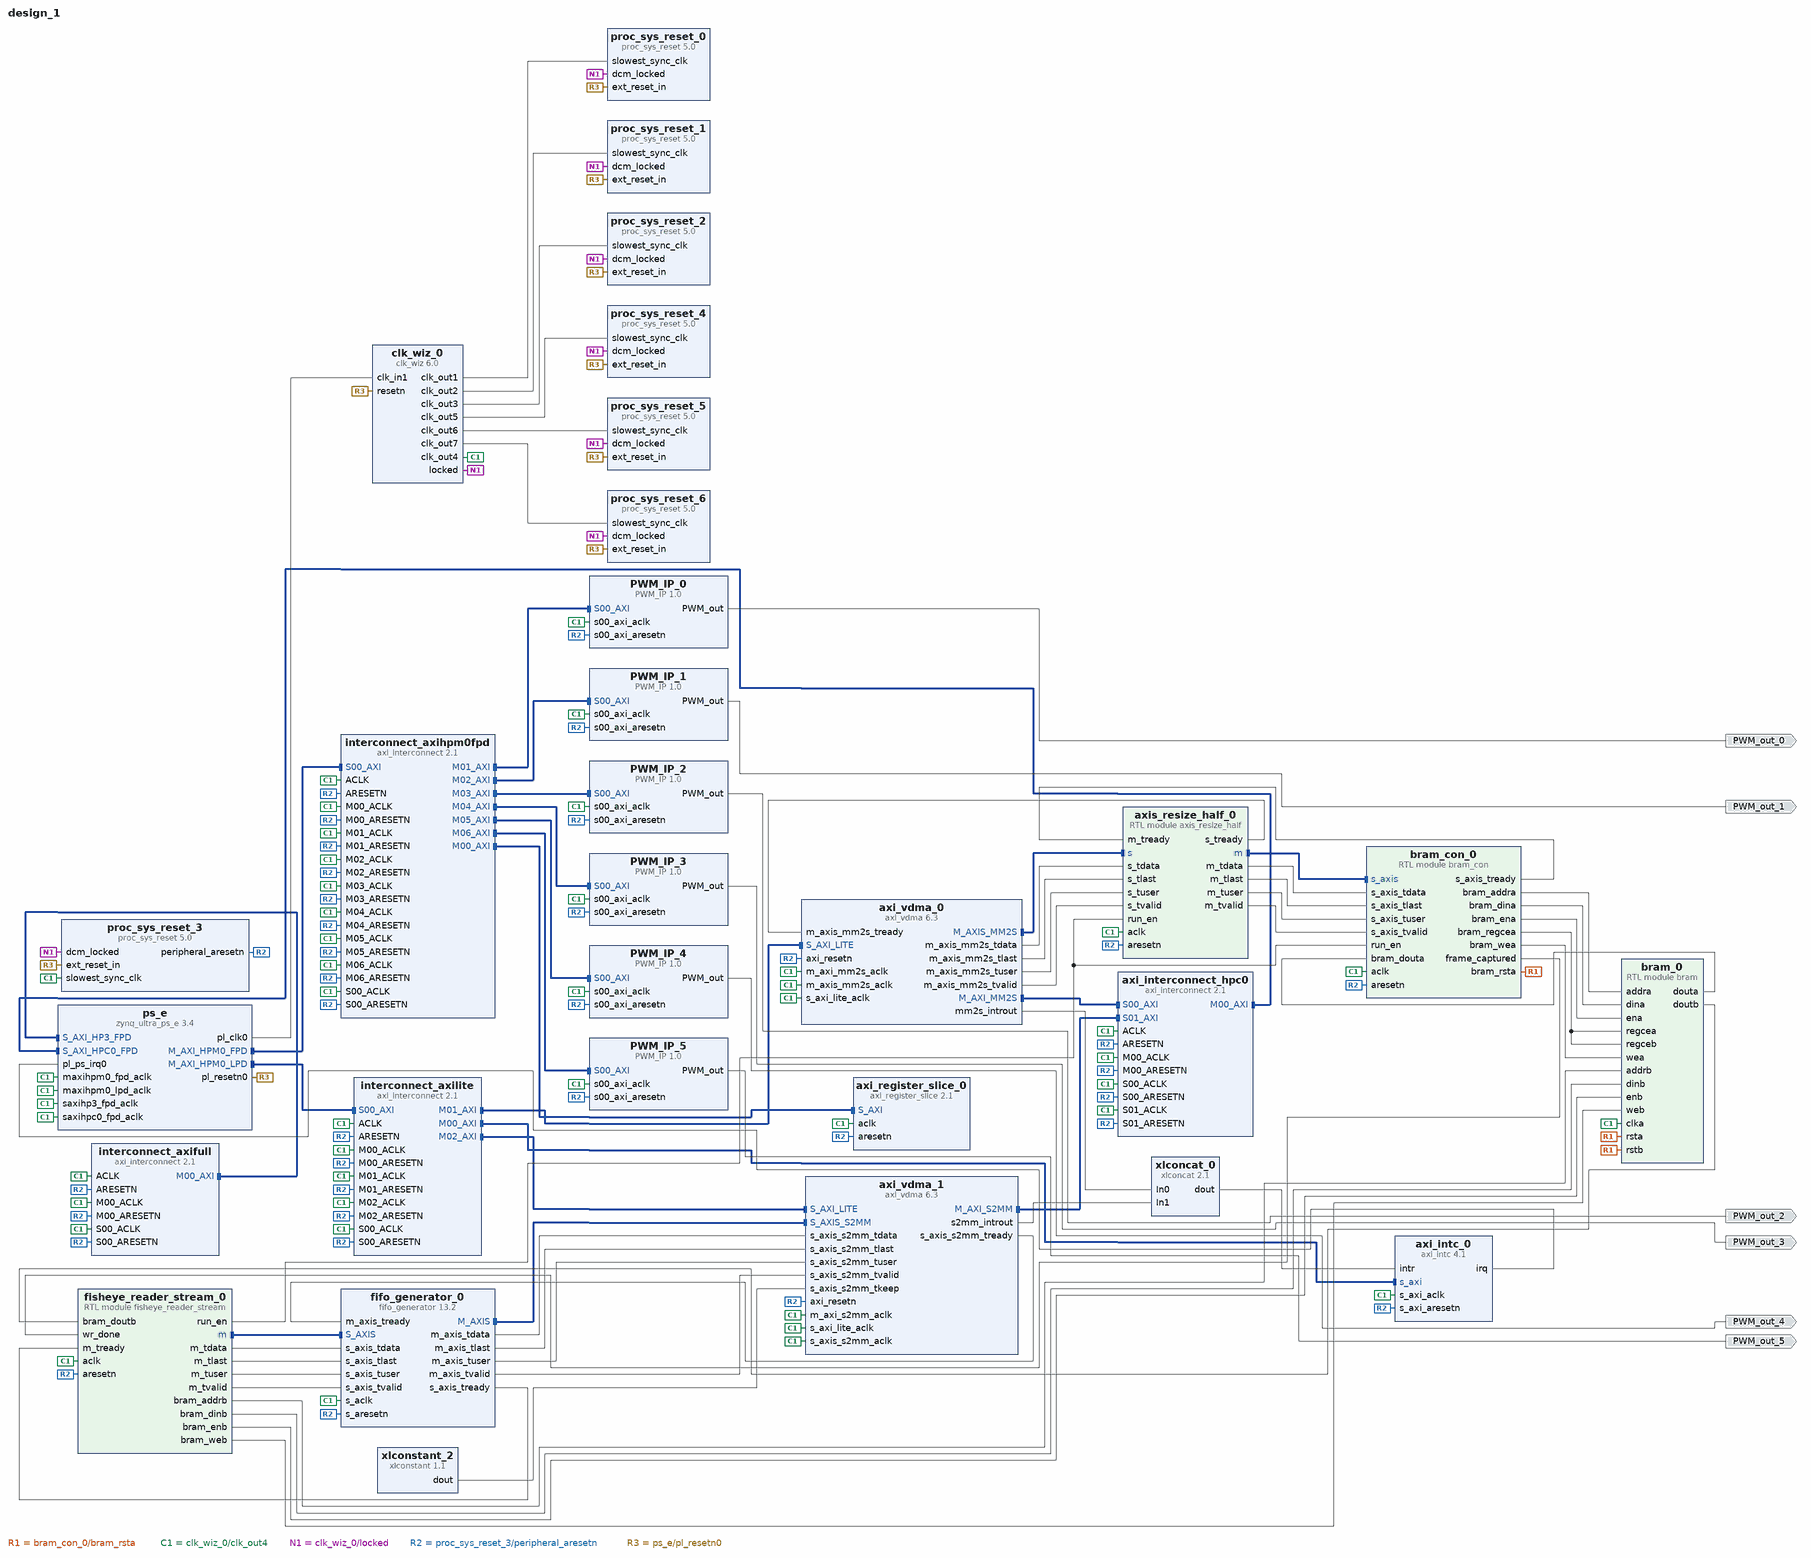
[diagram p0: block diagram of the top level]
# Vivado block design design_1, xczu3eg-sbva484-1-i, Vivado 2022.1
create_bd_design design_1

create_bd_port -dir O PWM_out_0
create_bd_port -dir O PWM_out_1
create_bd_port -dir O PWM_out_2
create_bd_port -dir O PWM_out_3
create_bd_port -dir O PWM_out_4
create_bd_port -dir O PWM_out_5

create_bd_cell -type ip -vlnv xilinx.com:ip:axi_intc:4.1 axi_intc_0
set_property -dict [list \
  CONFIG.C_ASYNC_INTR 0xFFFFFFFF \
  CONFIG.C_CASCADE_MASTER 0 \
  CONFIG.C_DISABLE_SYNCHRONIZERS 0 \
  CONFIG.C_ENABLE_ASYNC 0 \
  CONFIG.C_EN_CASCADE_MODE 0 \
  CONFIG.C_HAS_CIE 1 \
  CONFIG.C_HAS_FAST 0 \
  CONFIG.C_HAS_ILR 0 \
  CONFIG.C_HAS_IPR 1 \
  CONFIG.C_HAS_IVR 1 \
  CONFIG.C_HAS_SIE 1 \
  CONFIG.C_IRQ_ACTIVE 0x1 \
  CONFIG.C_IRQ_CONNECTION 1 \
  CONFIG.C_IRQ_IS_LEVEL 1 \
  CONFIG.C_KIND_OF_EDGE 0xFFFFFFFF \
  CONFIG.C_KIND_OF_INTR 0xFFFFFFFF \
  CONFIG.C_KIND_OF_LVL 0xFFFFFFFF \
  CONFIG.C_MB_CLK_NOT_CONNECTED 1 \
  CONFIG.C_NUM_SW_INTR 0 \
  CONFIG.C_NUM_SYNC_FF 2 \
  CONFIG.C_PROCESSOR_CLK_FREQ_MHZ 100.0 \
  CONFIG.C_S_AXI_ACLK_FREQ_MHZ 75.0 \
  CONFIG.Sense_of_IRQ_Edge_Type Rising \
  CONFIG.Sense_of_IRQ_Level_Type Active_High \
] [get_bd_cells axi_intc_0]
create_bd_cell -type ip -vlnv xilinx.com:ip:axi_interconnect:2.1 axi_interconnect_hpc0
set_property -dict [list \
  CONFIG.ENABLE_ADVANCED_OPTIONS 0 \
  CONFIG.ENABLE_PROTOCOL_CHECKERS 0 \
  CONFIG.M00_HAS_DATA_FIFO 0 \
  CONFIG.M00_HAS_REGSLICE 0 \
  CONFIG.M00_ISSUANCE 0 \
  CONFIG.M00_SECURE 0 \
  CONFIG.M01_HAS_DATA_FIFO 0 \
  CONFIG.M01_HAS_REGSLICE 0 \
  CONFIG.M01_ISSUANCE 0 \
  CONFIG.M01_SECURE 0 \
  CONFIG.M02_HAS_DATA_FIFO 0 \
  CONFIG.M02_HAS_REGSLICE 0 \
  CONFIG.M02_ISSUANCE 0 \
  CONFIG.M02_SECURE 0 \
  CONFIG.M03_HAS_DATA_FIFO 0 \
  CONFIG.M03_HAS_REGSLICE 0 \
  CONFIG.M03_ISSUANCE 0 \
  CONFIG.M03_SECURE 0 \
  CONFIG.M04_HAS_DATA_FIFO 0 \
  CONFIG.M04_HAS_REGSLICE 0 \
  CONFIG.M04_ISSUANCE 0 \
  CONFIG.M04_SECURE 0 \
  CONFIG.M05_HAS_DATA_FIFO 0 \
  CONFIG.M05_HAS_REGSLICE 0 \
  CONFIG.M05_ISSUANCE 0 \
  CONFIG.M05_SECURE 0 \
  CONFIG.M06_HAS_DATA_FIFO 0 \
  CONFIG.M06_HAS_REGSLICE 0 \
  CONFIG.M06_ISSUANCE 0 \
  CONFIG.M06_SECURE 0 \
  CONFIG.M07_HAS_DATA_FIFO 0 \
  CONFIG.M07_HAS_REGSLICE 0 \
  CONFIG.M07_ISSUANCE 0 \
  CONFIG.M07_SECURE 0 \
  CONFIG.M08_HAS_DATA_FIFO 0 \
  CONFIG.M08_HAS_REGSLICE 0 \
  CONFIG.M08_ISSUANCE 0 \
  CONFIG.M08_SECURE 0 \
  CONFIG.M09_HAS_DATA_FIFO 0 \
  CONFIG.M09_HAS_REGSLICE 0 \
  CONFIG.M09_ISSUANCE 0 \
  CONFIG.M09_SECURE 0 \
  CONFIG.M10_HAS_DATA_FIFO 0 \
  CONFIG.M10_HAS_REGSLICE 0 \
  CONFIG.M10_ISSUANCE 0 \
  CONFIG.M10_SECURE 0 \
  CONFIG.M11_HAS_DATA_FIFO 0 \
  CONFIG.M11_HAS_REGSLICE 0 \
  CONFIG.M11_ISSUANCE 0 \
  CONFIG.M11_SECURE 0 \
  CONFIG.M12_HAS_DATA_FIFO 0 \
  CONFIG.M12_HAS_REGSLICE 0 \
  CONFIG.M12_ISSUANCE 0 \
  CONFIG.M12_SECURE 0 \
  CONFIG.M13_HAS_DATA_FIFO 0 \
  CONFIG.M13_HAS_REGSLICE 0 \
  CONFIG.M13_ISSUANCE 0 \
  CONFIG.M13_SECURE 0 \
  CONFIG.M14_HAS_DATA_FIFO 0 \
  CONFIG.M14_HAS_REGSLICE 0 \
  CONFIG.M14_ISSUANCE 0 \
  CONFIG.M14_SECURE 0 \
  CONFIG.M15_HAS_DATA_FIFO 0 \
  CONFIG.M15_HAS_REGSLICE 0 \
  CONFIG.M15_ISSUANCE 0 \
  CONFIG.M15_SECURE 0 \
  CONFIG.M16_HAS_DATA_FIFO 0 \
  CONFIG.M16_HAS_REGSLICE 0 \
  CONFIG.M16_ISSUANCE 0 \
  CONFIG.M16_SECURE 0 \
  CONFIG.M17_HAS_DATA_FIFO 0 \
  CONFIG.M17_HAS_REGSLICE 0 \
  CONFIG.M17_ISSUANCE 0 \
  CONFIG.M17_SECURE 0 \
  CONFIG.M18_HAS_DATA_FIFO 0 \
  CONFIG.M18_HAS_REGSLICE 0 \
  CONFIG.M18_ISSUANCE 0 \
  CONFIG.M18_SECURE 0 \
  CONFIG.M19_HAS_DATA_FIFO 0 \
  CONFIG.M19_HAS_REGSLICE 0 \
  CONFIG.M19_ISSUANCE 0 \
  CONFIG.M19_SECURE 0 \
  CONFIG.M20_HAS_DATA_FIFO 0 \
  CONFIG.M20_HAS_REGSLICE 0 \
  CONFIG.M20_ISSUANCE 0 \
  CONFIG.M20_SECURE 0 \
  CONFIG.M21_HAS_DATA_FIFO 0 \
  CONFIG.M21_HAS_REGSLICE 0 \
  CONFIG.M21_ISSUANCE 0 \
  CONFIG.M21_SECURE 0 \
  CONFIG.M22_HAS_DATA_FIFO 0 \
  CONFIG.M22_HAS_REGSLICE 0 \
  CONFIG.M22_ISSUANCE 0 \
  CONFIG.M22_SECURE 0 \
  CONFIG.M23_HAS_DATA_FIFO 0 \
  CONFIG.M23_HAS_REGSLICE 0 \
  CONFIG.M23_ISSUANCE 0 \
  CONFIG.M23_SECURE 0 \
  CONFIG.M24_HAS_DATA_FIFO 0 \
  CONFIG.M24_HAS_REGSLICE 0 \
  CONFIG.M24_ISSUANCE 0 \
  CONFIG.M24_SECURE 0 \
  CONFIG.M25_HAS_DATA_FIFO 0 \
  CONFIG.M25_HAS_REGSLICE 0 \
  CONFIG.M25_ISSUANCE 0 \
  CONFIG.M25_SECURE 0 \
  CONFIG.M26_HAS_DATA_FIFO 0 \
  CONFIG.M26_HAS_REGSLICE 0 \
  CONFIG.M26_ISSUANCE 0 \
  CONFIG.M26_SECURE 0 \
  CONFIG.M27_HAS_DATA_FIFO 0 \
  CONFIG.M27_HAS_REGSLICE 0 \
  CONFIG.M27_ISSUANCE 0 \
  CONFIG.M27_SECURE 0 \
  CONFIG.M28_HAS_DATA_FIFO 0 \
  CONFIG.M28_HAS_REGSLICE 0 \
  CONFIG.M28_ISSUANCE 0 \
  CONFIG.M28_SECURE 0 \
  CONFIG.M29_HAS_DATA_FIFO 0 \
  CONFIG.M29_HAS_REGSLICE 0 \
  CONFIG.M29_ISSUANCE 0 \
  CONFIG.M29_SECURE 0 \
  CONFIG.M30_HAS_DATA_FIFO 0 \
  CONFIG.M30_HAS_REGSLICE 0 \
  CONFIG.M30_ISSUANCE 0 \
  CONFIG.M30_SECURE 0 \
  CONFIG.M31_HAS_DATA_FIFO 0 \
  CONFIG.M31_HAS_REGSLICE 0 \
  CONFIG.M31_ISSUANCE 0 \
  CONFIG.M31_SECURE 0 \
  CONFIG.M32_HAS_DATA_FIFO 0 \
  CONFIG.M32_HAS_REGSLICE 0 \
  CONFIG.M32_ISSUANCE 0 \
  CONFIG.M32_SECURE 0 \
  CONFIG.M33_HAS_DATA_FIFO 0 \
  CONFIG.M33_HAS_REGSLICE 0 \
  CONFIG.M33_ISSUANCE 0 \
  CONFIG.M33_SECURE 0 \
  CONFIG.M34_HAS_DATA_FIFO 0 \
  CONFIG.M34_HAS_REGSLICE 0 \
  CONFIG.M34_ISSUANCE 0 \
  CONFIG.M34_SECURE 0 \
  CONFIG.M35_HAS_DATA_FIFO 0 \
  CONFIG.M35_HAS_REGSLICE 0 \
  CONFIG.M35_ISSUANCE 0 \
  CONFIG.M35_SECURE 0 \
  CONFIG.M36_HAS_DATA_FIFO 0 \
  CONFIG.M36_HAS_REGSLICE 0 \
  CONFIG.M36_ISSUANCE 0 \
  CONFIG.M36_SECURE 0 \
  CONFIG.M37_HAS_DATA_FIFO 0 \
  CONFIG.M37_HAS_REGSLICE 0 \
  CONFIG.M37_ISSUANCE 0 \
  CONFIG.M37_SECURE 0 \
  CONFIG.M38_HAS_DATA_FIFO 0 \
  CONFIG.M38_HAS_REGSLICE 0 \
  CONFIG.M38_ISSUANCE 0 \
  CONFIG.M38_SECURE 0 \
  CONFIG.M39_HAS_DATA_FIFO 0 \
  CONFIG.M39_HAS_REGSLICE 0 \
  CONFIG.M39_ISSUANCE 0 \
  CONFIG.M39_SECURE 0 \
  CONFIG.M40_HAS_DATA_FIFO 0 \
  CONFIG.M40_HAS_REGSLICE 0 \
  CONFIG.M40_ISSUANCE 0 \
  CONFIG.M40_SECURE 0 \
  CONFIG.M41_HAS_DATA_FIFO 0 \
  CONFIG.M41_HAS_REGSLICE 0 \
  CONFIG.M41_ISSUANCE 0 \
  CONFIG.M41_SECURE 0 \
  CONFIG.M42_HAS_DATA_FIFO 0 \
  CONFIG.M42_HAS_REGSLICE 0 \
  CONFIG.M42_ISSUANCE 0 \
  CONFIG.M42_SECURE 0 \
  CONFIG.M43_HAS_DATA_FIFO 0 \
  CONFIG.M43_HAS_REGSLICE 0 \
  CONFIG.M43_ISSUANCE 0 \
  CONFIG.M43_SECURE 0 \
  CONFIG.M44_HAS_DATA_FIFO 0 \
  CONFIG.M44_HAS_REGSLICE 0 \
  CONFIG.M44_ISSUANCE 0 \
  CONFIG.M44_SECURE 0 \
  CONFIG.M45_HAS_DATA_FIFO 0 \
  CONFIG.M45_HAS_REGSLICE 0 \
  CONFIG.M45_ISSUANCE 0 \
  CONFIG.M45_SECURE 0 \
  CONFIG.M46_HAS_DATA_FIFO 0 \
  CONFIG.M46_HAS_REGSLICE 0 \
  CONFIG.M46_ISSUANCE 0 \
  CONFIG.M46_SECURE 0 \
  CONFIG.M47_HAS_DATA_FIFO 0 \
  CONFIG.M47_HAS_REGSLICE 0 \
  CONFIG.M47_ISSUANCE 0 \
  CONFIG.M47_SECURE 0 \
  CONFIG.M48_HAS_DATA_FIFO 0 \
  CONFIG.M48_HAS_REGSLICE 0 \
  CONFIG.M48_ISSUANCE 0 \
  CONFIG.M48_SECURE 0 \
  CONFIG.M49_HAS_DATA_FIFO 0 \
  CONFIG.M49_HAS_REGSLICE 0 \
  CONFIG.M49_ISSUANCE 0 \
  CONFIG.M49_SECURE 0 \
  CONFIG.M50_HAS_DATA_FIFO 0 \
  CONFIG.M50_HAS_REGSLICE 0 \
  CONFIG.M50_ISSUANCE 0 \
  CONFIG.M50_SECURE 0 \
  CONFIG.M51_HAS_DATA_FIFO 0 \
  CONFIG.M51_HAS_REGSLICE 0 \
  CONFIG.M51_ISSUANCE 0 \
  CONFIG.M51_SECURE 0 \
  CONFIG.M52_HAS_DATA_FIFO 0 \
  CONFIG.M52_HAS_REGSLICE 0 \
  CONFIG.M52_ISSUANCE 0 \
  CONFIG.M52_SECURE 0 \
  CONFIG.M53_HAS_DATA_FIFO 0 \
  CONFIG.M53_HAS_REGSLICE 0 \
  CONFIG.M53_ISSUANCE 0 \
  CONFIG.M53_SECURE 0 \
  CONFIG.M54_HAS_DATA_FIFO 0 \
  CONFIG.M54_HAS_REGSLICE 0 \
  CONFIG.M54_ISSUANCE 0 \
  CONFIG.M54_SECURE 0 \
  CONFIG.M55_HAS_DATA_FIFO 0 \
  CONFIG.M55_HAS_REGSLICE 0 \
  CONFIG.M55_ISSUANCE 0 \
  CONFIG.M55_SECURE 0 \
  CONFIG.M56_HAS_DATA_FIFO 0 \
  CONFIG.M56_HAS_REGSLICE 0 \
  CONFIG.M56_ISSUANCE 0 \
  CONFIG.M56_SECURE 0 \
  CONFIG.M57_HAS_DATA_FIFO 0 \
  CONFIG.M57_HAS_REGSLICE 0 \
  CONFIG.M57_ISSUANCE 0 \
  CONFIG.M57_SECURE 0 \
  CONFIG.M58_HAS_DATA_FIFO 0 \
  CONFIG.M58_HAS_REGSLICE 0 \
  CONFIG.M58_ISSUANCE 0 \
  CONFIG.M58_SECURE 0 \
  CONFIG.M59_HAS_DATA_FIFO 0 \
  CONFIG.M59_HAS_REGSLICE 0 \
  CONFIG.M59_ISSUANCE 0 \
  CONFIG.M59_SECURE 0 \
  CONFIG.M60_HAS_DATA_FIFO 0 \
  CONFIG.M60_HAS_REGSLICE 0 \
  CONFIG.M60_ISSUANCE 0 \
  CONFIG.M60_SECURE 0 \
  CONFIG.M61_HAS_DATA_FIFO 0 \
  CONFIG.M61_HAS_REGSLICE 0 \
  CONFIG.M61_ISSUANCE 0 \
  CONFIG.M61_SECURE 0 \
  CONFIG.M62_HAS_DATA_FIFO 0 \
  CONFIG.M62_HAS_REGSLICE 0 \
  CONFIG.M62_ISSUANCE 0 \
  CONFIG.M62_SECURE 0 \
  CONFIG.M63_HAS_DATA_FIFO 0 \
  CONFIG.M63_HAS_REGSLICE 0 \
  CONFIG.M63_ISSUANCE 0 \
  CONFIG.M63_SECURE 0 \
  CONFIG.NUM_MI 1 \
  CONFIG.NUM_SI 2 \
  CONFIG.PCHK_MAX_RD_BURSTS 2 \
  CONFIG.PCHK_MAX_WR_BURSTS 2 \
  CONFIG.PCHK_WAITS 0 \
  CONFIG.S00_ARB_PRIORITY 0 \
  CONFIG.S00_HAS_DATA_FIFO 0 \
  CONFIG.S00_HAS_REGSLICE 0 \
  CONFIG.S01_ARB_PRIORITY 0 \
  CONFIG.S01_HAS_DATA_FIFO 0 \
  CONFIG.S01_HAS_REGSLICE 0 \
  CONFIG.S02_ARB_PRIORITY 0 \
  CONFIG.S02_HAS_DATA_FIFO 0 \
  CONFIG.S02_HAS_REGSLICE 0 \
  CONFIG.S03_ARB_PRIORITY 0 \
  CONFIG.S03_HAS_DATA_FIFO 0 \
  CONFIG.S03_HAS_REGSLICE 0 \
  CONFIG.S04_ARB_PRIORITY 0 \
  CONFIG.S04_HAS_DATA_FIFO 0 \
  CONFIG.S04_HAS_REGSLICE 0 \
  CONFIG.S05_ARB_PRIORITY 0 \
  CONFIG.S05_HAS_DATA_FIFO 0 \
  CONFIG.S05_HAS_REGSLICE 0 \
  CONFIG.S06_ARB_PRIORITY 0 \
  CONFIG.S06_HAS_DATA_FIFO 0 \
  CONFIG.S06_HAS_REGSLICE 0 \
  CONFIG.S07_ARB_PRIORITY 0 \
  CONFIG.S07_HAS_DATA_FIFO 0 \
  CONFIG.S07_HAS_REGSLICE 0 \
  CONFIG.S08_ARB_PRIORITY 0 \
  CONFIG.S08_HAS_DATA_FIFO 0 \
  CONFIG.S08_HAS_REGSLICE 0 \
  CONFIG.S09_ARB_PRIORITY 0 \
  CONFIG.S09_HAS_DATA_FIFO 0 \
  CONFIG.S09_HAS_REGSLICE 0 \
  CONFIG.S10_ARB_PRIORITY 0 \
  CONFIG.S10_HAS_DATA_FIFO 0 \
  CONFIG.S10_HAS_REGSLICE 0 \
  CONFIG.S11_ARB_PRIORITY 0 \
  CONFIG.S11_HAS_DATA_FIFO 0 \
  CONFIG.S11_HAS_REGSLICE 0 \
  CONFIG.S12_ARB_PRIORITY 0 \
  CONFIG.S12_HAS_DATA_FIFO 0 \
  CONFIG.S12_HAS_REGSLICE 0 \
  CONFIG.S13_ARB_PRIORITY 0 \
  CONFIG.S13_HAS_DATA_FIFO 0 \
  CONFIG.S13_HAS_REGSLICE 0 \
  CONFIG.S14_ARB_PRIORITY 0 \
  CONFIG.S14_HAS_DATA_FIFO 0 \
  CONFIG.S14_HAS_REGSLICE 0 \
  CONFIG.S15_ARB_PRIORITY 0 \
  CONFIG.S15_HAS_DATA_FIFO 0 \
  CONFIG.S15_HAS_REGSLICE 0 \
  CONFIG.STRATEGY 0 \
  CONFIG.SYNCHRONIZATION_STAGES 3 \
  CONFIG.XBAR_DATA_WIDTH 32 \
] [get_bd_cells axi_interconnect_hpc0]
create_bd_cell -type ip -vlnv xilinx.com:ip:axi_register_slice:2.1 axi_register_slice_0
set_property -dict [list \
  CONFIG.ADDR_WIDTH 40 \
  CONFIG.ARUSER_WIDTH 16 \
  CONFIG.AWUSER_WIDTH 16 \
  CONFIG.BUSER_WIDTH 0 \
  CONFIG.DATA_WIDTH 128 \
  CONFIG.HAS_BRESP 1 \
  CONFIG.HAS_BURST 1 \
  CONFIG.HAS_CACHE 1 \
  CONFIG.HAS_LOCK 1 \
  CONFIG.HAS_PROT 1 \
  CONFIG.HAS_QOS 1 \
  CONFIG.HAS_REGION 1 \
  CONFIG.HAS_RRESP 1 \
  CONFIG.HAS_WSTRB 1 \
  CONFIG.ID_WIDTH 16 \
  CONFIG.MAX_BURST_LENGTH 256 \
  CONFIG.NUM_READ_OUTSTANDING 8 \
  CONFIG.NUM_READ_THREADS 4 \
  CONFIG.NUM_WRITE_OUTSTANDING 8 \
  CONFIG.NUM_WRITE_THREADS 4 \
  CONFIG.PROTOCOL AXI4 \
  CONFIG.READ_WRITE_MODE READ_WRITE \
  CONFIG.REG_AR 7 \
  CONFIG.REG_AW 7 \
  CONFIG.REG_B 7 \
  CONFIG.REG_R 1 \
  CONFIG.REG_W 1 \
  CONFIG.RESERVE_MODE 0 \
  CONFIG.RUSER_BITS_PER_BYTE 0 \
  CONFIG.RUSER_WIDTH 0 \
  CONFIG.SUPPORTS_NARROW_BURST 1 \
  CONFIG.WUSER_BITS_PER_BYTE 0 \
  CONFIG.WUSER_WIDTH 0 \
] [get_bd_cells axi_register_slice_0]
create_bd_cell -type ip -vlnv xilinx.com:ip:clk_wiz:6.0 clk_wiz_0
set_property -dict [list \
  CONFIG.AUTO_PRIMITIVE MMCM \
  CONFIG.AXI_DRP false \
  CONFIG.CALC_DONE empty \
  CONFIG.CDDCDONE_PORT cddcdone \
  CONFIG.CDDCREQ_PORT cddcreq \
  CONFIG.CLKFB_IN_N_PORT clkfb_in_n \
  CONFIG.CLKFB_IN_PORT clkfb_in \
  CONFIG.CLKFB_IN_P_PORT clkfb_in_p \
  CONFIG.CLKFB_IN_SIGNALING SINGLE \
  CONFIG.CLKFB_OUT_N_PORT clkfb_out_n \
  CONFIG.CLKFB_OUT_PORT clkfb_out \
  CONFIG.CLKFB_OUT_P_PORT clkfb_out_p \
  CONFIG.CLKFB_STOPPED_PORT clkfb_stopped \
  CONFIG.CLKIN1_JITTER_PS 100.01 \
  CONFIG.CLKIN1_UI_JITTER 0.010 \
  CONFIG.CLKIN2_JITTER_PS 100.0 \
  CONFIG.CLKIN2_UI_JITTER 0.010 \
  CONFIG.CLKOUT1_DRIVES Buffer \
  CONFIG.CLKOUT1_JITTER 107.579 \
  CONFIG.CLKOUT1_MATCHED_ROUTING false \
  CONFIG.CLKOUT1_PHASE_ERROR 87.187 \
  CONFIG.CLKOUT1_REQUESTED_DUTY_CYCLE 50.000 \
  CONFIG.CLKOUT1_REQUESTED_OUT_FREQ 150 \
  CONFIG.CLKOUT1_REQUESTED_PHASE 0.000 \
  CONFIG.CLKOUT1_SEQUENCE_NUMBER 1 \
  CONFIG.CLKOUT1_USED true \
  CONFIG.CLKOUT2_DRIVES Buffer \
  CONFIG.CLKOUT2_JITTER 94.872 \
  CONFIG.CLKOUT2_MATCHED_ROUTING false \
  CONFIG.CLKOUT2_PHASE_ERROR 87.187 \
  CONFIG.CLKOUT2_REQUESTED_DUTY_CYCLE 50.000 \
  CONFIG.CLKOUT2_REQUESTED_OUT_FREQ 300 \
  CONFIG.CLKOUT2_REQUESTED_PHASE 0.000 \
  CONFIG.CLKOUT2_SEQUENCE_NUMBER 1 \
  CONFIG.CLKOUT2_USED true \
  CONFIG.CLKOUT3_DRIVES Buffer \
  CONFIG.CLKOUT3_JITTER 122.171 \
  CONFIG.CLKOUT3_MATCHED_ROUTING false \
  CONFIG.CLKOUT3_PHASE_ERROR 87.187 \
  CONFIG.CLKOUT3_REQUESTED_DUTY_CYCLE 50.000 \
  CONFIG.CLKOUT3_REQUESTED_OUT_FREQ 75 \
  CONFIG.CLKOUT3_REQUESTED_PHASE 0.000 \
  CONFIG.CLKOUT3_SEQUENCE_NUMBER 1 \
  CONFIG.CLKOUT3_USED true \
  CONFIG.CLKOUT4_DRIVES Buffer \
  CONFIG.CLKOUT4_JITTER 115.843 \
  CONFIG.CLKOUT4_MATCHED_ROUTING false \
  CONFIG.CLKOUT4_PHASE_ERROR 87.187 \
  CONFIG.CLKOUT4_REQUESTED_DUTY_CYCLE 50.000 \
  CONFIG.CLKOUT4_REQUESTED_OUT_FREQ 100.000 \
  CONFIG.CLKOUT4_REQUESTED_PHASE 0.000 \
  CONFIG.CLKOUT4_SEQUENCE_NUMBER 1 \
  CONFIG.CLKOUT4_USED true \
  CONFIG.CLKOUT5_DRIVES Buffer \
  CONFIG.CLKOUT5_JITTER 102.096 \
  CONFIG.CLKOUT5_MATCHED_ROUTING false \
  CONFIG.CLKOUT5_PHASE_ERROR 87.187 \
  CONFIG.CLKOUT5_REQUESTED_DUTY_CYCLE 50.000 \
  CONFIG.CLKOUT5_REQUESTED_OUT_FREQ 200.000 \
  CONFIG.CLKOUT5_REQUESTED_PHASE 0.000 \
  CONFIG.CLKOUT5_SEQUENCE_NUMBER 1 \
  CONFIG.CLKOUT5_USED true \
  CONFIG.CLKOUT6_DRIVES Buffer \
  CONFIG.CLKOUT6_JITTER 90.083 \
  CONFIG.CLKOUT6_MATCHED_ROUTING false \
  CONFIG.CLKOUT6_PHASE_ERROR 87.187 \
  CONFIG.CLKOUT6_REQUESTED_DUTY_CYCLE 50.000 \
  CONFIG.CLKOUT6_REQUESTED_OUT_FREQ 400.000 \
  CONFIG.CLKOUT6_REQUESTED_PHASE 0.000 \
  CONFIG.CLKOUT6_SEQUENCE_NUMBER 1 \
  CONFIG.CLKOUT6_USED true \
  CONFIG.CLKOUT7_DRIVES Buffer \
  CONFIG.CLKOUT7_JITTER 83.777 \
  CONFIG.CLKOUT7_MATCHED_ROUTING false \
  CONFIG.CLKOUT7_PHASE_ERROR 87.187 \
  CONFIG.CLKOUT7_REQUESTED_DUTY_CYCLE 50.000 \
  CONFIG.CLKOUT7_REQUESTED_OUT_FREQ 600.000 \
  CONFIG.CLKOUT7_REQUESTED_PHASE 0.000 \
  CONFIG.CLKOUT7_SEQUENCE_NUMBER 1 \
  CONFIG.CLKOUT7_USED true \
  CONFIG.CLKOUTPHY_REQUESTED_FREQ 600.000 \
  CONFIG.CLK_IN1_BOARD_INTERFACE Custom \
  CONFIG.CLK_IN2_BOARD_INTERFACE Custom \
  CONFIG.CLK_IN_SEL_PORT clk_in_sel \
  CONFIG.CLK_OUT1_PORT clk_out1 \
  CONFIG.CLK_OUT1_USE_FINE_PS_GUI false \
  CONFIG.CLK_OUT2_PORT clk_out2 \
  CONFIG.CLK_OUT2_USE_FINE_PS_GUI false \
  CONFIG.CLK_OUT3_PORT clk_out3 \
  CONFIG.CLK_OUT3_USE_FINE_PS_GUI false \
  CONFIG.CLK_OUT4_PORT clk_out4 \
  CONFIG.CLK_OUT4_USE_FINE_PS_GUI false \
  CONFIG.CLK_OUT5_PORT clk_out5 \
  CONFIG.CLK_OUT5_USE_FINE_PS_GUI false \
  CONFIG.CLK_OUT6_PORT clk_out6 \
  CONFIG.CLK_OUT6_USE_FINE_PS_GUI false \
  CONFIG.CLK_OUT7_PORT clk_out7 \
  CONFIG.CLK_OUT7_USE_FINE_PS_GUI false \
  CONFIG.CLK_VALID_PORT CLK_VALID \
  CONFIG.CLOCK_MGR_TYPE auto \
  CONFIG.DADDR_PORT daddr \
  CONFIG.DCLK_PORT dclk \
  CONFIG.DEN_PORT den \
  CONFIG.DIFF_CLK_IN1_BOARD_INTERFACE Custom \
  CONFIG.DIFF_CLK_IN2_BOARD_INTERFACE Custom \
  CONFIG.DIN_PORT din \
  CONFIG.DOUT_PORT dout \
  CONFIG.DRDY_PORT drdy \
  CONFIG.DWE_PORT dwe \
  CONFIG.ENABLE_CDDC false \
  CONFIG.ENABLE_CLKOUTPHY false \
  CONFIG.ENABLE_CLOCK_MONITOR false \
  CONFIG.ENABLE_USER_CLOCK0 false \
  CONFIG.ENABLE_USER_CLOCK1 false \
  CONFIG.ENABLE_USER_CLOCK2 false \
  CONFIG.ENABLE_USER_CLOCK3 false \
  CONFIG.Enable_PLL0 false \
  CONFIG.Enable_PLL1 false \
  CONFIG.FEEDBACK_SOURCE FDBK_AUTO \
  CONFIG.INPUT_CLK_STOPPED_PORT input_clk_stopped \
  CONFIG.INPUT_MODE frequency \
  CONFIG.INTERFACE_SELECTION Enable_AXI \
  CONFIG.IN_FREQ_UNITS Units_MHz \
  CONFIG.IN_JITTER_UNITS Units_UI \
  CONFIG.JITTER_OPTIONS UI \
  CONFIG.JITTER_SEL No_Jitter \
  CONFIG.LOCKED_PORT locked \
  CONFIG.MMCM_BANDWIDTH OPTIMIZED \
  CONFIG.MMCM_CLKFBOUT_MULT_F 12.000 \
  CONFIG.MMCM_CLKFBOUT_PHASE 0.000 \
  CONFIG.MMCM_CLKFBOUT_USE_FINE_PS false \
  CONFIG.MMCM_CLKIN1_PERIOD 10.000 \
  CONFIG.MMCM_CLKIN2_PERIOD 10.000 \
  CONFIG.MMCM_CLKOUT0_DIVIDE_F 8.000 \
  CONFIG.MMCM_CLKOUT0_DUTY_CYCLE 0.500 \
  CONFIG.MMCM_CLKOUT0_PHASE 0.000 \
  CONFIG.MMCM_CLKOUT0_USE_FINE_PS false \
  CONFIG.MMCM_CLKOUT1_DIVIDE 4 \
  CONFIG.MMCM_CLKOUT1_DUTY_CYCLE 0.500 \
  CONFIG.MMCM_CLKOUT1_PHASE 0.000 \
  CONFIG.MMCM_CLKOUT1_USE_FINE_PS false \
  CONFIG.MMCM_CLKOUT2_DIVIDE 16 \
  CONFIG.MMCM_CLKOUT2_DUTY_CYCLE 0.500 \
  CONFIG.MMCM_CLKOUT2_PHASE 0.000 \
  CONFIG.MMCM_CLKOUT2_USE_FINE_PS false \
  CONFIG.MMCM_CLKOUT3_DIVIDE 12 \
  CONFIG.MMCM_CLKOUT3_DUTY_CYCLE 0.500 \
  CONFIG.MMCM_CLKOUT3_PHASE 0.000 \
  CONFIG.MMCM_CLKOUT3_USE_FINE_PS false \
  CONFIG.MMCM_CLKOUT4_CASCADE false \
  CONFIG.MMCM_CLKOUT4_DIVIDE 6 \
  CONFIG.MMCM_CLKOUT4_DUTY_CYCLE 0.500 \
  CONFIG.MMCM_CLKOUT4_PHASE 0.000 \
  CONFIG.MMCM_CLKOUT4_USE_FINE_PS false \
  CONFIG.MMCM_CLKOUT5_DIVIDE 3 \
  CONFIG.MMCM_CLKOUT5_DUTY_CYCLE 0.500 \
  CONFIG.MMCM_CLKOUT5_PHASE 0.000 \
  CONFIG.MMCM_CLKOUT5_USE_FINE_PS false \
  CONFIG.MMCM_CLKOUT6_DIVIDE 2 \
  CONFIG.MMCM_CLKOUT6_DUTY_CYCLE 0.500 \
  CONFIG.MMCM_CLKOUT6_PHASE 0.000 \
  CONFIG.MMCM_CLKOUT6_USE_FINE_PS false \
  CONFIG.MMCM_CLOCK_HOLD false \
  CONFIG.MMCM_COMPENSATION AUTO \
  CONFIG.MMCM_DIVCLK_DIVIDE 1 \
  CONFIG.MMCM_NOTES None \
  CONFIG.MMCM_REF_JITTER1 0.010 \
  CONFIG.MMCM_REF_JITTER2 0.010 \
  CONFIG.MMCM_STARTUP_WAIT false \
  CONFIG.NUM_OUT_CLKS 7 \
  CONFIG.OPTIMIZE_CLOCKING_STRUCTURE_EN false \
  CONFIG.OVERRIDE_MMCM false \
  CONFIG.OVERRIDE_PLL false \
  CONFIG.PHASESHIFT_MODE LATENCY \
  CONFIG.PHASE_DUTY_CONFIG false \
  CONFIG.PLATFORM UNKNOWN \
  CONFIG.PLL_BANDWIDTH OPTIMIZED \
  CONFIG.PLL_CLKFBOUT_MULT 4 \
  CONFIG.PLL_CLKFBOUT_PHASE 0.000 \
  CONFIG.PLL_CLKIN_PERIOD 10.000 \
  CONFIG.PLL_CLKOUT0_DIVIDE 1 \
  CONFIG.PLL_CLKOUT0_DUTY_CYCLE 0.500 \
  CONFIG.PLL_CLKOUT0_PHASE 0.000 \
  CONFIG.PLL_CLKOUT1_DIVIDE 1 \
  CONFIG.PLL_CLKOUT1_DUTY_CYCLE 0.500 \
  CONFIG.PLL_CLKOUT1_PHASE 0.000 \
  CONFIG.PLL_CLKOUT2_DIVIDE 1 \
  CONFIG.PLL_CLKOUT2_DUTY_CYCLE 0.500 \
  CONFIG.PLL_CLKOUT2_PHASE 0.000 \
  CONFIG.PLL_CLKOUT3_DIVIDE 1 \
  CONFIG.PLL_CLKOUT3_DUTY_CYCLE 0.500 \
  CONFIG.PLL_CLKOUT3_PHASE 0.000 \
  CONFIG.PLL_CLKOUT4_DIVIDE 1 \
  CONFIG.PLL_CLKOUT4_DUTY_CYCLE 0.500 \
  CONFIG.PLL_CLKOUT4_PHASE 0.000 \
  CONFIG.PLL_CLKOUT5_DIVIDE 1 \
  CONFIG.PLL_CLKOUT5_DUTY_CYCLE 0.500 \
  CONFIG.PLL_CLKOUT5_PHASE 0.000 \
  CONFIG.PLL_CLK_FEEDBACK CLKFBOUT \
  CONFIG.PLL_COMPENSATION SYSTEM_SYNCHRONOUS \
  CONFIG.PLL_DIVCLK_DIVIDE 1 \
  CONFIG.PLL_NOTES None \
  CONFIG.PLL_REF_JITTER 0.010 \
  CONFIG.POWER_DOWN_PORT power_down \
  CONFIG.PRECISION 1 \
  CONFIG.PRIMARY_PORT clk_in1 \
  CONFIG.PRIMITIVE MMCM \
  CONFIG.PRIMTYPE_SEL mmcm_adv \
  CONFIG.PRIM_IN_FREQ 100.000 \
  CONFIG.PRIM_IN_JITTER 0.010 \
  CONFIG.PRIM_IN_TIMEPERIOD 10.000 \
  CONFIG.PRIM_SOURCE Single_ended_clock_capable_pin \
  CONFIG.PSCLK_PORT psclk \
  CONFIG.PSDONE_PORT psdone \
  CONFIG.PSEN_PORT psen \
  CONFIG.PSINCDEC_PORT psincdec \
  CONFIG.REF_CLK_FREQ 100.0 \
  CONFIG.RELATIVE_INCLK REL_PRIMARY \
  CONFIG.RESET_BOARD_INTERFACE Custom \
  CONFIG.RESET_PORT resetn \
  CONFIG.RESET_TYPE ACTIVE_LOW \
  CONFIG.SECONDARY_IN_FREQ 100.000 \
  CONFIG.SECONDARY_IN_JITTER 0.010 \
  CONFIG.SECONDARY_IN_TIMEPERIOD 10.000 \
  CONFIG.SECONDARY_PORT clk_in2 \
  CONFIG.SECONDARY_SOURCE Single_ended_clock_capable_pin \
  CONFIG.SS_MODE CENTER_HIGH \
  CONFIG.SS_MOD_FREQ 250 \
  CONFIG.SS_MOD_TIME 0.004 \
  CONFIG.STATUS_PORT STATUS \
  CONFIG.SUMMARY_STRINGS empty \
  CONFIG.USER_CLK_FREQ0 100.0 \
  CONFIG.USER_CLK_FREQ1 100.0 \
  CONFIG.USER_CLK_FREQ2 100.0 \
  CONFIG.USER_CLK_FREQ3 100.0 \
  CONFIG.USE_BOARD_FLOW false \
  CONFIG.USE_CLKFB_STOPPED false \
  CONFIG.USE_CLK_VALID false \
  CONFIG.USE_CLOCK_SEQUENCING false \
  CONFIG.USE_DYN_PHASE_SHIFT false \
  CONFIG.USE_DYN_RECONFIG false \
  CONFIG.USE_FREEZE false \
  CONFIG.USE_FREQ_SYNTH true \
  CONFIG.USE_INCLK_STOPPED false \
  CONFIG.USE_INCLK_SWITCHOVER false \
  CONFIG.USE_LOCKED true \
  CONFIG.USE_MAX_I_JITTER false \
  CONFIG.USE_MIN_O_JITTER false \
  CONFIG.USE_MIN_POWER false \
  CONFIG.USE_PHASE_ALIGNMENT false \
  CONFIG.USE_POWER_DOWN false \
  CONFIG.USE_RESET true \
  CONFIG.USE_SAFE_CLOCK_STARTUP false \
  CONFIG.USE_SPREAD_SPECTRUM false \
  CONFIG.USE_STATUS false \
] [get_bd_cells clk_wiz_0]
create_bd_cell -type ip -vlnv xilinx.com:ip:axi_interconnect:2.1 interconnect_axifull
set_property -dict [list \
  CONFIG.ENABLE_ADVANCED_OPTIONS 0 \
  CONFIG.ENABLE_PROTOCOL_CHECKERS 0 \
  CONFIG.M00_HAS_DATA_FIFO 0 \
  CONFIG.M00_HAS_REGSLICE 0 \
  CONFIG.M00_ISSUANCE 0 \
  CONFIG.M00_SECURE 0 \
  CONFIG.M01_HAS_DATA_FIFO 0 \
  CONFIG.M01_HAS_REGSLICE 0 \
  CONFIG.M01_ISSUANCE 0 \
  CONFIG.M01_SECURE 0 \
  CONFIG.M02_HAS_DATA_FIFO 0 \
  CONFIG.M02_HAS_REGSLICE 0 \
  CONFIG.M02_ISSUANCE 0 \
  CONFIG.M02_SECURE 0 \
  CONFIG.M03_HAS_DATA_FIFO 0 \
  CONFIG.M03_HAS_REGSLICE 0 \
  CONFIG.M03_ISSUANCE 0 \
  CONFIG.M03_SECURE 0 \
  CONFIG.M04_HAS_DATA_FIFO 0 \
  CONFIG.M04_HAS_REGSLICE 0 \
  CONFIG.M04_ISSUANCE 0 \
  CONFIG.M04_SECURE 0 \
  CONFIG.M05_HAS_DATA_FIFO 0 \
  CONFIG.M05_HAS_REGSLICE 0 \
  CONFIG.M05_ISSUANCE 0 \
  CONFIG.M05_SECURE 0 \
  CONFIG.M06_HAS_DATA_FIFO 0 \
  CONFIG.M06_HAS_REGSLICE 0 \
  CONFIG.M06_ISSUANCE 0 \
  CONFIG.M06_SECURE 0 \
  CONFIG.M07_HAS_DATA_FIFO 0 \
  CONFIG.M07_HAS_REGSLICE 0 \
  CONFIG.M07_ISSUANCE 0 \
  CONFIG.M07_SECURE 0 \
  CONFIG.M08_HAS_DATA_FIFO 0 \
  CONFIG.M08_HAS_REGSLICE 0 \
  CONFIG.M08_ISSUANCE 0 \
  CONFIG.M08_SECURE 0 \
  CONFIG.M09_HAS_DATA_FIFO 0 \
  CONFIG.M09_HAS_REGSLICE 0 \
  CONFIG.M09_ISSUANCE 0 \
  CONFIG.M09_SECURE 0 \
  CONFIG.M10_HAS_DATA_FIFO 0 \
  CONFIG.M10_HAS_REGSLICE 0 \
  CONFIG.M10_ISSUANCE 0 \
  CONFIG.M10_SECURE 0 \
  CONFIG.M11_HAS_DATA_FIFO 0 \
  CONFIG.M11_HAS_REGSLICE 0 \
  CONFIG.M11_ISSUANCE 0 \
  CONFIG.M11_SECURE 0 \
  CONFIG.M12_HAS_DATA_FIFO 0 \
  CONFIG.M12_HAS_REGSLICE 0 \
  CONFIG.M12_ISSUANCE 0 \
  CONFIG.M12_SECURE 0 \
  CONFIG.M13_HAS_DATA_FIFO 0 \
  CONFIG.M13_HAS_REGSLICE 0 \
  CONFIG.M13_ISSUANCE 0 \
  CONFIG.M13_SECURE 0 \
  CONFIG.M14_HAS_DATA_FIFO 0 \
  CONFIG.M14_HAS_REGSLICE 0 \
  CONFIG.M14_ISSUANCE 0 \
  CONFIG.M14_SECURE 0 \
  CONFIG.M15_HAS_DATA_FIFO 0 \
  CONFIG.M15_HAS_REGSLICE 0 \
  CONFIG.M15_ISSUANCE 0 \
  CONFIG.M15_SECURE 0 \
  CONFIG.M16_HAS_DATA_FIFO 0 \
  CONFIG.M16_HAS_REGSLICE 0 \
  CONFIG.M16_ISSUANCE 0 \
  CONFIG.M16_SECURE 0 \
  CONFIG.M17_HAS_DATA_FIFO 0 \
  CONFIG.M17_HAS_REGSLICE 0 \
  CONFIG.M17_ISSUANCE 0 \
  CONFIG.M17_SECURE 0 \
  CONFIG.M18_HAS_DATA_FIFO 0 \
  CONFIG.M18_HAS_REGSLICE 0 \
  CONFIG.M18_ISSUANCE 0 \
  CONFIG.M18_SECURE 0 \
  CONFIG.M19_HAS_DATA_FIFO 0 \
  CONFIG.M19_HAS_REGSLICE 0 \
  CONFIG.M19_ISSUANCE 0 \
  CONFIG.M19_SECURE 0 \
  CONFIG.M20_HAS_DATA_FIFO 0 \
  CONFIG.M20_HAS_REGSLICE 0 \
  CONFIG.M20_ISSUANCE 0 \
  CONFIG.M20_SECURE 0 \
  CONFIG.M21_HAS_DATA_FIFO 0 \
  CONFIG.M21_HAS_REGSLICE 0 \
  CONFIG.M21_ISSUANCE 0 \
  CONFIG.M21_SECURE 0 \
  CONFIG.M22_HAS_DATA_FIFO 0 \
  CONFIG.M22_HAS_REGSLICE 0 \
  CONFIG.M22_ISSUANCE 0 \
  CONFIG.M22_SECURE 0 \
  CONFIG.M23_HAS_DATA_FIFO 0 \
  CONFIG.M23_HAS_REGSLICE 0 \
  CONFIG.M23_ISSUANCE 0 \
  CONFIG.M23_SECURE 0 \
  CONFIG.M24_HAS_DATA_FIFO 0 \
  CONFIG.M24_HAS_REGSLICE 0 \
  CONFIG.M24_ISSUANCE 0 \
  CONFIG.M24_SECURE 0 \
  CONFIG.M25_HAS_DATA_FIFO 0 \
  CONFIG.M25_HAS_REGSLICE 0 \
  CONFIG.M25_ISSUANCE 0 \
  CONFIG.M25_SECURE 0 \
  CONFIG.M26_HAS_DATA_FIFO 0 \
  CONFIG.M26_HAS_REGSLICE 0 \
  CONFIG.M26_ISSUANCE 0 \
  CONFIG.M26_SECURE 0 \
  CONFIG.M27_HAS_DATA_FIFO 0 \
  CONFIG.M27_HAS_REGSLICE 0 \
  CONFIG.M27_ISSUANCE 0 \
  CONFIG.M27_SECURE 0 \
  CONFIG.M28_HAS_DATA_FIFO 0 \
  CONFIG.M28_HAS_REGSLICE 0 \
  CONFIG.M28_ISSUANCE 0 \
  CONFIG.M28_SECURE 0 \
  CONFIG.M29_HAS_DATA_FIFO 0 \
  CONFIG.M29_HAS_REGSLICE 0 \
  CONFIG.M29_ISSUANCE 0 \
  CONFIG.M29_SECURE 0 \
  CONFIG.M30_HAS_DATA_FIFO 0 \
  CONFIG.M30_HAS_REGSLICE 0 \
  CONFIG.M30_ISSUANCE 0 \
  CONFIG.M30_SECURE 0 \
  CONFIG.M31_HAS_DATA_FIFO 0 \
  CONFIG.M31_HAS_REGSLICE 0 \
  CONFIG.M31_ISSUANCE 0 \
  CONFIG.M31_SECURE 0 \
  CONFIG.M32_HAS_DATA_FIFO 0 \
  CONFIG.M32_HAS_REGSLICE 0 \
  CONFIG.M32_ISSUANCE 0 \
  CONFIG.M32_SECURE 0 \
  CONFIG.M33_HAS_DATA_FIFO 0 \
  CONFIG.M33_HAS_REGSLICE 0 \
  CONFIG.M33_ISSUANCE 0 \
  CONFIG.M33_SECURE 0 \
  CONFIG.M34_HAS_DATA_FIFO 0 \
  CONFIG.M34_HAS_REGSLICE 0 \
  CONFIG.M34_ISSUANCE 0 \
  CONFIG.M34_SECURE 0 \
  CONFIG.M35_HAS_DATA_FIFO 0 \
  CONFIG.M35_HAS_REGSLICE 0 \
  CONFIG.M35_ISSUANCE 0 \
  CONFIG.M35_SECURE 0 \
  CONFIG.M36_HAS_DATA_FIFO 0 \
  CONFIG.M36_HAS_REGSLICE 0 \
  CONFIG.M36_ISSUANCE 0 \
  CONFIG.M36_SECURE 0 \
  CONFIG.M37_HAS_DATA_FIFO 0 \
  CONFIG.M37_HAS_REGSLICE 0 \
  CONFIG.M37_ISSUANCE 0 \
  CONFIG.M37_SECURE 0 \
  CONFIG.M38_HAS_DATA_FIFO 0 \
  CONFIG.M38_HAS_REGSLICE 0 \
  CONFIG.M38_ISSUANCE 0 \
  CONFIG.M38_SECURE 0 \
  CONFIG.M39_HAS_DATA_FIFO 0 \
  CONFIG.M39_HAS_REGSLICE 0 \
  CONFIG.M39_ISSUANCE 0 \
  CONFIG.M39_SECURE 0 \
  CONFIG.M40_HAS_DATA_FIFO 0 \
  CONFIG.M40_HAS_REGSLICE 0 \
  CONFIG.M40_ISSUANCE 0 \
  CONFIG.M40_SECURE 0 \
  CONFIG.M41_HAS_DATA_FIFO 0 \
  CONFIG.M41_HAS_REGSLICE 0 \
  CONFIG.M41_ISSUANCE 0 \
  CONFIG.M41_SECURE 0 \
  CONFIG.M42_HAS_DATA_FIFO 0 \
  CONFIG.M42_HAS_REGSLICE 0 \
  CONFIG.M42_ISSUANCE 0 \
  CONFIG.M42_SECURE 0 \
  CONFIG.M43_HAS_DATA_FIFO 0 \
  CONFIG.M43_HAS_REGSLICE 0 \
  CONFIG.M43_ISSUANCE 0 \
  CONFIG.M43_SECURE 0 \
  CONFIG.M44_HAS_DATA_FIFO 0 \
  CONFIG.M44_HAS_REGSLICE 0 \
  CONFIG.M44_ISSUANCE 0 \
  CONFIG.M44_SECURE 0 \
  CONFIG.M45_HAS_DATA_FIFO 0 \
  CONFIG.M45_HAS_REGSLICE 0 \
  CONFIG.M45_ISSUANCE 0 \
  CONFIG.M45_SECURE 0 \
  CONFIG.M46_HAS_DATA_FIFO 0 \
  CONFIG.M46_HAS_REGSLICE 0 \
  CONFIG.M46_ISSUANCE 0 \
  CONFIG.M46_SECURE 0 \
  CONFIG.M47_HAS_DATA_FIFO 0 \
  CONFIG.M47_HAS_REGSLICE 0 \
  CONFIG.M47_ISSUANCE 0 \
  CONFIG.M47_SECURE 0 \
  CONFIG.M48_HAS_DATA_FIFO 0 \
  CONFIG.M48_HAS_REGSLICE 0 \
  CONFIG.M48_ISSUANCE 0 \
  CONFIG.M48_SECURE 0 \
  CONFIG.M49_HAS_DATA_FIFO 0 \
  CONFIG.M49_HAS_REGSLICE 0 \
  CONFIG.M49_ISSUANCE 0 \
  CONFIG.M49_SECURE 0 \
  CONFIG.M50_HAS_DATA_FIFO 0 \
  CONFIG.M50_HAS_REGSLICE 0 \
  CONFIG.M50_ISSUANCE 0 \
  CONFIG.M50_SECURE 0 \
  CONFIG.M51_HAS_DATA_FIFO 0 \
  CONFIG.M51_HAS_REGSLICE 0 \
  CONFIG.M51_ISSUANCE 0 \
  CONFIG.M51_SECURE 0 \
  CONFIG.M52_HAS_DATA_FIFO 0 \
  CONFIG.M52_HAS_REGSLICE 0 \
  CONFIG.M52_ISSUANCE 0 \
  CONFIG.M52_SECURE 0 \
  CONFIG.M53_HAS_DATA_FIFO 0 \
  CONFIG.M53_HAS_REGSLICE 0 \
  CONFIG.M53_ISSUANCE 0 \
  CONFIG.M53_SECURE 0 \
  CONFIG.M54_HAS_DATA_FIFO 0 \
  CONFIG.M54_HAS_REGSLICE 0 \
  CONFIG.M54_ISSUANCE 0 \
  CONFIG.M54_SECURE 0 \
  CONFIG.M55_HAS_DATA_FIFO 0 \
  CONFIG.M55_HAS_REGSLICE 0 \
  CONFIG.M55_ISSUANCE 0 \
  CONFIG.M55_SECURE 0 \
  CONFIG.M56_HAS_DATA_FIFO 0 \
  CONFIG.M56_HAS_REGSLICE 0 \
  CONFIG.M56_ISSUANCE 0 \
  CONFIG.M56_SECURE 0 \
  CONFIG.M57_HAS_DATA_FIFO 0 \
  CONFIG.M57_HAS_REGSLICE 0 \
  CONFIG.M57_ISSUANCE 0 \
  CONFIG.M57_SECURE 0 \
  CONFIG.M58_HAS_DATA_FIFO 0 \
  CONFIG.M58_HAS_REGSLICE 0 \
  CONFIG.M58_ISSUANCE 0 \
  CONFIG.M58_SECURE 0 \
  CONFIG.M59_HAS_DATA_FIFO 0 \
  CONFIG.M59_HAS_REGSLICE 0 \
  CONFIG.M59_ISSUANCE 0 \
  CONFIG.M59_SECURE 0 \
  CONFIG.M60_HAS_DATA_FIFO 0 \
  CONFIG.M60_HAS_REGSLICE 0 \
  CONFIG.M60_ISSUANCE 0 \
  CONFIG.M60_SECURE 0 \
  CONFIG.M61_HAS_DATA_FIFO 0 \
  CONFIG.M61_HAS_REGSLICE 0 \
  CONFIG.M61_ISSUANCE 0 \
  CONFIG.M61_SECURE 0 \
  CONFIG.M62_HAS_DATA_FIFO 0 \
  CONFIG.M62_HAS_REGSLICE 0 \
  CONFIG.M62_ISSUANCE 0 \
  CONFIG.M62_SECURE 0 \
  CONFIG.M63_HAS_DATA_FIFO 0 \
  CONFIG.M63_HAS_REGSLICE 0 \
  CONFIG.M63_ISSUANCE 0 \
  CONFIG.M63_SECURE 0 \
  CONFIG.NUM_MI 1 \
  CONFIG.NUM_SI 1 \
  CONFIG.PCHK_MAX_RD_BURSTS 2 \
  CONFIG.PCHK_MAX_WR_BURSTS 2 \
  CONFIG.PCHK_WAITS 0 \
  CONFIG.S00_ARB_PRIORITY 0 \
  CONFIG.S00_HAS_DATA_FIFO 0 \
  CONFIG.S00_HAS_REGSLICE 0 \
  CONFIG.S01_ARB_PRIORITY 0 \
  CONFIG.S01_HAS_DATA_FIFO 0 \
  CONFIG.S01_HAS_REGSLICE 0 \
  CONFIG.S02_ARB_PRIORITY 0 \
  CONFIG.S02_HAS_DATA_FIFO 0 \
  CONFIG.S02_HAS_REGSLICE 0 \
  CONFIG.S03_ARB_PRIORITY 0 \
  CONFIG.S03_HAS_DATA_FIFO 0 \
  CONFIG.S03_HAS_REGSLICE 0 \
  CONFIG.S04_ARB_PRIORITY 0 \
  CONFIG.S04_HAS_DATA_FIFO 0 \
  CONFIG.S04_HAS_REGSLICE 0 \
  CONFIG.S05_ARB_PRIORITY 0 \
  CONFIG.S05_HAS_DATA_FIFO 0 \
  CONFIG.S05_HAS_REGSLICE 0 \
  CONFIG.S06_ARB_PRIORITY 0 \
  CONFIG.S06_HAS_DATA_FIFO 0 \
  CONFIG.S06_HAS_REGSLICE 0 \
  CONFIG.S07_ARB_PRIORITY 0 \
  CONFIG.S07_HAS_DATA_FIFO 0 \
  CONFIG.S07_HAS_REGSLICE 0 \
  CONFIG.S08_ARB_PRIORITY 0 \
  CONFIG.S08_HAS_DATA_FIFO 0 \
  CONFIG.S08_HAS_REGSLICE 0 \
  CONFIG.S09_ARB_PRIORITY 0 \
  CONFIG.S09_HAS_DATA_FIFO 0 \
  CONFIG.S09_HAS_REGSLICE 0 \
  CONFIG.S10_ARB_PRIORITY 0 \
  CONFIG.S10_HAS_DATA_FIFO 0 \
  CONFIG.S10_HAS_REGSLICE 0 \
  CONFIG.S11_ARB_PRIORITY 0 \
  CONFIG.S11_HAS_DATA_FIFO 0 \
  CONFIG.S11_HAS_REGSLICE 0 \
  CONFIG.S12_ARB_PRIORITY 0 \
  CONFIG.S12_HAS_DATA_FIFO 0 \
  CONFIG.S12_HAS_REGSLICE 0 \
  CONFIG.S13_ARB_PRIORITY 0 \
  CONFIG.S13_HAS_DATA_FIFO 0 \
  CONFIG.S13_HAS_REGSLICE 0 \
  CONFIG.S14_ARB_PRIORITY 0 \
  CONFIG.S14_HAS_DATA_FIFO 0 \
  CONFIG.S14_HAS_REGSLICE 0 \
  CONFIG.S15_ARB_PRIORITY 0 \
  CONFIG.S15_HAS_DATA_FIFO 0 \
  CONFIG.S15_HAS_REGSLICE 0 \
  CONFIG.STRATEGY 0 \
  CONFIG.SYNCHRONIZATION_STAGES 3 \
  CONFIG.XBAR_DATA_WIDTH 32 \
] [get_bd_cells interconnect_axifull]
create_bd_cell -type ip -vlnv xilinx.com:ip:axi_interconnect:2.1 interconnect_axihpm0fpd
set_property -dict [list \
  CONFIG.ENABLE_ADVANCED_OPTIONS 0 \
  CONFIG.ENABLE_PROTOCOL_CHECKERS 0 \
  CONFIG.M00_HAS_DATA_FIFO 0 \
  CONFIG.M00_HAS_REGSLICE 0 \
  CONFIG.M00_ISSUANCE 0 \
  CONFIG.M00_SECURE 0 \
  CONFIG.M01_HAS_DATA_FIFO 0 \
  CONFIG.M01_HAS_REGSLICE 0 \
  CONFIG.M01_ISSUANCE 0 \
  CONFIG.M01_SECURE 0 \
  CONFIG.M02_HAS_DATA_FIFO 0 \
  CONFIG.M02_HAS_REGSLICE 0 \
  CONFIG.M02_ISSUANCE 0 \
  CONFIG.M02_SECURE 0 \
  CONFIG.M03_HAS_DATA_FIFO 0 \
  CONFIG.M03_HAS_REGSLICE 0 \
  CONFIG.M03_ISSUANCE 0 \
  CONFIG.M03_SECURE 0 \
  CONFIG.M04_HAS_DATA_FIFO 0 \
  CONFIG.M04_HAS_REGSLICE 0 \
  CONFIG.M04_ISSUANCE 0 \
  CONFIG.M04_SECURE 0 \
  CONFIG.M05_HAS_DATA_FIFO 0 \
  CONFIG.M05_HAS_REGSLICE 0 \
  CONFIG.M05_ISSUANCE 0 \
  CONFIG.M05_SECURE 0 \
  CONFIG.M06_HAS_DATA_FIFO 0 \
  CONFIG.M06_HAS_REGSLICE 0 \
  CONFIG.M06_ISSUANCE 0 \
  CONFIG.M06_SECURE 0 \
  CONFIG.M07_HAS_DATA_FIFO 0 \
  CONFIG.M07_HAS_REGSLICE 0 \
  CONFIG.M07_ISSUANCE 0 \
  CONFIG.M07_SECURE 0 \
  CONFIG.M08_HAS_DATA_FIFO 0 \
  CONFIG.M08_HAS_REGSLICE 0 \
  CONFIG.M08_ISSUANCE 0 \
  CONFIG.M08_SECURE 0 \
  CONFIG.M09_HAS_DATA_FIFO 0 \
  CONFIG.M09_HAS_REGSLICE 0 \
  CONFIG.M09_ISSUANCE 0 \
  CONFIG.M09_SECURE 0 \
  CONFIG.M10_HAS_DATA_FIFO 0 \
  CONFIG.M10_HAS_REGSLICE 0 \
  CONFIG.M10_ISSUANCE 0 \
  CONFIG.M10_SECURE 0 \
  CONFIG.M11_HAS_DATA_FIFO 0 \
  CONFIG.M11_HAS_REGSLICE 0 \
  CONFIG.M11_ISSUANCE 0 \
  CONFIG.M11_SECURE 0 \
  CONFIG.M12_HAS_DATA_FIFO 0 \
  CONFIG.M12_HAS_REGSLICE 0 \
  CONFIG.M12_ISSUANCE 0 \
  CONFIG.M12_SECURE 0 \
  CONFIG.M13_HAS_DATA_FIFO 0 \
  CONFIG.M13_HAS_REGSLICE 0 \
  CONFIG.M13_ISSUANCE 0 \
  CONFIG.M13_SECURE 0 \
  CONFIG.M14_HAS_DATA_FIFO 0 \
  CONFIG.M14_HAS_REGSLICE 0 \
  CONFIG.M14_ISSUANCE 0 \
  CONFIG.M14_SECURE 0 \
  CONFIG.M15_HAS_DATA_FIFO 0 \
  CONFIG.M15_HAS_REGSLICE 0 \
  CONFIG.M15_ISSUANCE 0 \
  CONFIG.M15_SECURE 0 \
  CONFIG.M16_HAS_DATA_FIFO 0 \
  CONFIG.M16_HAS_REGSLICE 0 \
  CONFIG.M16_ISSUANCE 0 \
  CONFIG.M16_SECURE 0 \
  CONFIG.M17_HAS_DATA_FIFO 0 \
  CONFIG.M17_HAS_REGSLICE 0 \
  CONFIG.M17_ISSUANCE 0 \
  CONFIG.M17_SECURE 0 \
  CONFIG.M18_HAS_DATA_FIFO 0 \
  CONFIG.M18_HAS_REGSLICE 0 \
  CONFIG.M18_ISSUANCE 0 \
  CONFIG.M18_SECURE 0 \
  CONFIG.M19_HAS_DATA_FIFO 0 \
  CONFIG.M19_HAS_REGSLICE 0 \
  CONFIG.M19_ISSUANCE 0 \
  CONFIG.M19_SECURE 0 \
  CONFIG.M20_HAS_DATA_FIFO 0 \
  CONFIG.M20_HAS_REGSLICE 0 \
  CONFIG.M20_ISSUANCE 0 \
  CONFIG.M20_SECURE 0 \
  CONFIG.M21_HAS_DATA_FIFO 0 \
  CONFIG.M21_HAS_REGSLICE 0 \
  CONFIG.M21_ISSUANCE 0 \
  CONFIG.M21_SECURE 0 \
  CONFIG.M22_HAS_DATA_FIFO 0 \
  CONFIG.M22_HAS_REGSLICE 0 \
  CONFIG.M22_ISSUANCE 0 \
  CONFIG.M22_SECURE 0 \
  CONFIG.M23_HAS_DATA_FIFO 0 \
  CONFIG.M23_HAS_REGSLICE 0 \
  CONFIG.M23_ISSUANCE 0 \
  CONFIG.M23_SECURE 0 \
  CONFIG.M24_HAS_DATA_FIFO 0 \
  CONFIG.M24_HAS_REGSLICE 0 \
  CONFIG.M24_ISSUANCE 0 \
  CONFIG.M24_SECURE 0 \
  CONFIG.M25_HAS_DATA_FIFO 0 \
  CONFIG.M25_HAS_REGSLICE 0 \
  CONFIG.M25_ISSUANCE 0 \
  CONFIG.M25_SECURE 0 \
  CONFIG.M26_HAS_DATA_FIFO 0 \
  CONFIG.M26_HAS_REGSLICE 0 \
  CONFIG.M26_ISSUANCE 0 \
  CONFIG.M26_SECURE 0 \
  CONFIG.M27_HAS_DATA_FIFO 0 \
  CONFIG.M27_HAS_REGSLICE 0 \
  CONFIG.M27_ISSUANCE 0 \
  CONFIG.M27_SECURE 0 \
  CONFIG.M28_HAS_DATA_FIFO 0 \
  CONFIG.M28_HAS_REGSLICE 0 \
  CONFIG.M28_ISSUANCE 0 \
  CONFIG.M28_SECURE 0 \
  CONFIG.M29_HAS_DATA_FIFO 0 \
  CONFIG.M29_HAS_REGSLICE 0 \
  CONFIG.M29_ISSUANCE 0 \
  CONFIG.M29_SECURE 0 \
  CONFIG.M30_HAS_DATA_FIFO 0 \
  CONFIG.M30_HAS_REGSLICE 0 \
  CONFIG.M30_ISSUANCE 0 \
  CONFIG.M30_SECURE 0 \
  CONFIG.M31_HAS_DATA_FIFO 0 \
  CONFIG.M31_HAS_REGSLICE 0 \
  CONFIG.M31_ISSUANCE 0 \
  CONFIG.M31_SECURE 0 \
  CONFIG.M32_HAS_DATA_FIFO 0 \
  CONFIG.M32_HAS_REGSLICE 0 \
  CONFIG.M32_ISSUANCE 0 \
  CONFIG.M32_SECURE 0 \
  CONFIG.M33_HAS_DATA_FIFO 0 \
  CONFIG.M33_HAS_REGSLICE 0 \
  CONFIG.M33_ISSUANCE 0 \
  CONFIG.M33_SECURE 0 \
  CONFIG.M34_HAS_DATA_FIFO 0 \
  CONFIG.M34_HAS_REGSLICE 0 \
  CONFIG.M34_ISSUANCE 0 \
  CONFIG.M34_SECURE 0 \
  CONFIG.M35_HAS_DATA_FIFO 0 \
  CONFIG.M35_HAS_REGSLICE 0 \
  CONFIG.M35_ISSUANCE 0 \
  CONFIG.M35_SECURE 0 \
  CONFIG.M36_HAS_DATA_FIFO 0 \
  CONFIG.M36_HAS_REGSLICE 0 \
  CONFIG.M36_ISSUANCE 0 \
  CONFIG.M36_SECURE 0 \
  CONFIG.M37_HAS_DATA_FIFO 0 \
  CONFIG.M37_HAS_REGSLICE 0 \
  CONFIG.M37_ISSUANCE 0 \
  CONFIG.M37_SECURE 0 \
  CONFIG.M38_HAS_DATA_FIFO 0 \
  CONFIG.M38_HAS_REGSLICE 0 \
  CONFIG.M38_ISSUANCE 0 \
  CONFIG.M38_SECURE 0 \
  CONFIG.M39_HAS_DATA_FIFO 0 \
  CONFIG.M39_HAS_REGSLICE 0 \
  CONFIG.M39_ISSUANCE 0 \
  CONFIG.M39_SECURE 0 \
  CONFIG.M40_HAS_DATA_FIFO 0 \
  CONFIG.M40_HAS_REGSLICE 0 \
  CONFIG.M40_ISSUANCE 0 \
  CONFIG.M40_SECURE 0 \
  CONFIG.M41_HAS_DATA_FIFO 0 \
  CONFIG.M41_HAS_REGSLICE 0 \
  CONFIG.M41_ISSUANCE 0 \
  CONFIG.M41_SECURE 0 \
  CONFIG.M42_HAS_DATA_FIFO 0 \
  CONFIG.M42_HAS_REGSLICE 0 \
  CONFIG.M42_ISSUANCE 0 \
  CONFIG.M42_SECURE 0 \
  CONFIG.M43_HAS_DATA_FIFO 0 \
  CONFIG.M43_HAS_REGSLICE 0 \
  CONFIG.M43_ISSUANCE 0 \
  CONFIG.M43_SECURE 0 \
  CONFIG.M44_HAS_DATA_FIFO 0 \
  CONFIG.M44_HAS_REGSLICE 0 \
  CONFIG.M44_ISSUANCE 0 \
  CONFIG.M44_SECURE 0 \
  CONFIG.M45_HAS_DATA_FIFO 0 \
  CONFIG.M45_HAS_REGSLICE 0 \
  CONFIG.M45_ISSUANCE 0 \
  CONFIG.M45_SECURE 0 \
  CONFIG.M46_HAS_DATA_FIFO 0 \
  CONFIG.M46_HAS_REGSLICE 0 \
  CONFIG.M46_ISSUANCE 0 \
  CONFIG.M46_SECURE 0 \
  CONFIG.M47_HAS_DATA_FIFO 0 \
  CONFIG.M47_HAS_REGSLICE 0 \
  CONFIG.M47_ISSUANCE 0 \
  CONFIG.M47_SECURE 0 \
  CONFIG.M48_HAS_DATA_FIFO 0 \
  CONFIG.M48_HAS_REGSLICE 0 \
  CONFIG.M48_ISSUANCE 0 \
  CONFIG.M48_SECURE 0 \
  CONFIG.M49_HAS_DATA_FIFO 0 \
  CONFIG.M49_HAS_REGSLICE 0 \
  CONFIG.M49_ISSUANCE 0 \
  CONFIG.M49_SECURE 0 \
  CONFIG.M50_HAS_DATA_FIFO 0 \
  CONFIG.M50_HAS_REGSLICE 0 \
  CONFIG.M50_ISSUANCE 0 \
  CONFIG.M50_SECURE 0 \
  CONFIG.M51_HAS_DATA_FIFO 0 \
  CONFIG.M51_HAS_REGSLICE 0 \
  CONFIG.M51_ISSUANCE 0 \
  CONFIG.M51_SECURE 0 \
  CONFIG.M52_HAS_DATA_FIFO 0 \
  CONFIG.M52_HAS_REGSLICE 0 \
  CONFIG.M52_ISSUANCE 0 \
  CONFIG.M52_SECURE 0 \
  CONFIG.M53_HAS_DATA_FIFO 0 \
  CONFIG.M53_HAS_REGSLICE 0 \
  CONFIG.M53_ISSUANCE 0 \
  CONFIG.M53_SECURE 0 \
  CONFIG.M54_HAS_DATA_FIFO 0 \
  CONFIG.M54_HAS_REGSLICE 0 \
  CONFIG.M54_ISSUANCE 0 \
  CONFIG.M54_SECURE 0 \
  CONFIG.M55_HAS_DATA_FIFO 0 \
  CONFIG.M55_HAS_REGSLICE 0 \
  CONFIG.M55_ISSUANCE 0 \
  CONFIG.M55_SECURE 0 \
  CONFIG.M56_HAS_DATA_FIFO 0 \
  CONFIG.M56_HAS_REGSLICE 0 \
  CONFIG.M56_ISSUANCE 0 \
  CONFIG.M56_SECURE 0 \
  CONFIG.M57_HAS_DATA_FIFO 0 \
  CONFIG.M57_HAS_REGSLICE 0 \
  CONFIG.M57_ISSUANCE 0 \
  CONFIG.M57_SECURE 0 \
  CONFIG.M58_HAS_DATA_FIFO 0 \
  CONFIG.M58_HAS_REGSLICE 0 \
  CONFIG.M58_ISSUANCE 0 \
  CONFIG.M58_SECURE 0 \
  CONFIG.M59_HAS_DATA_FIFO 0 \
  CONFIG.M59_HAS_REGSLICE 0 \
  CONFIG.M59_ISSUANCE 0 \
  CONFIG.M59_SECURE 0 \
  CONFIG.M60_HAS_DATA_FIFO 0 \
  CONFIG.M60_HAS_REGSLICE 0 \
  CONFIG.M60_ISSUANCE 0 \
  CONFIG.M60_SECURE 0 \
  CONFIG.M61_HAS_DATA_FIFO 0 \
  CONFIG.M61_HAS_REGSLICE 0 \
  CONFIG.M61_ISSUANCE 0 \
  CONFIG.M61_SECURE 0 \
  CONFIG.M62_HAS_DATA_FIFO 0 \
  CONFIG.M62_HAS_REGSLICE 0 \
  CONFIG.M62_ISSUANCE 0 \
  CONFIG.M62_SECURE 0 \
  CONFIG.M63_HAS_DATA_FIFO 0 \
  CONFIG.M63_HAS_REGSLICE 0 \
  CONFIG.M63_ISSUANCE 0 \
  CONFIG.M63_SECURE 0 \
  CONFIG.NUM_MI 7 \
  CONFIG.NUM_SI 1 \
  CONFIG.PCHK_MAX_RD_BURSTS 2 \
  CONFIG.PCHK_MAX_WR_BURSTS 2 \
  CONFIG.PCHK_WAITS 0 \
  CONFIG.S00_ARB_PRIORITY 0 \
  CONFIG.S00_HAS_DATA_FIFO 0 \
  CONFIG.S00_HAS_REGSLICE 0 \
  CONFIG.S01_ARB_PRIORITY 0 \
  CONFIG.S01_HAS_DATA_FIFO 0 \
  CONFIG.S01_HAS_REGSLICE 0 \
  CONFIG.S02_ARB_PRIORITY 0 \
  CONFIG.S02_HAS_DATA_FIFO 0 \
  CONFIG.S02_HAS_REGSLICE 0 \
  CONFIG.S03_ARB_PRIORITY 0 \
  CONFIG.S03_HAS_DATA_FIFO 0 \
  CONFIG.S03_HAS_REGSLICE 0 \
  CONFIG.S04_ARB_PRIORITY 0 \
  CONFIG.S04_HAS_DATA_FIFO 0 \
  CONFIG.S04_HAS_REGSLICE 0 \
  CONFIG.S05_ARB_PRIORITY 0 \
  CONFIG.S05_HAS_DATA_FIFO 0 \
  CONFIG.S05_HAS_REGSLICE 0 \
  CONFIG.S06_ARB_PRIORITY 0 \
  CONFIG.S06_HAS_DATA_FIFO 0 \
  CONFIG.S06_HAS_REGSLICE 0 \
  CONFIG.S07_ARB_PRIORITY 0 \
  CONFIG.S07_HAS_DATA_FIFO 0 \
  CONFIG.S07_HAS_REGSLICE 0 \
  CONFIG.S08_ARB_PRIORITY 0 \
  CONFIG.S08_HAS_DATA_FIFO 0 \
  CONFIG.S08_HAS_REGSLICE 0 \
  CONFIG.S09_ARB_PRIORITY 0 \
  CONFIG.S09_HAS_DATA_FIFO 0 \
  CONFIG.S09_HAS_REGSLICE 0 \
  CONFIG.S10_ARB_PRIORITY 0 \
  CONFIG.S10_HAS_DATA_FIFO 0 \
  CONFIG.S10_HAS_REGSLICE 0 \
  CONFIG.S11_ARB_PRIORITY 0 \
  CONFIG.S11_HAS_DATA_FIFO 0 \
  CONFIG.S11_HAS_REGSLICE 0 \
  CONFIG.S12_ARB_PRIORITY 0 \
  CONFIG.S12_HAS_DATA_FIFO 0 \
  CONFIG.S12_HAS_REGSLICE 0 \
  CONFIG.S13_ARB_PRIORITY 0 \
  CONFIG.S13_HAS_DATA_FIFO 0 \
  CONFIG.S13_HAS_REGSLICE 0 \
  CONFIG.S14_ARB_PRIORITY 0 \
  CONFIG.S14_HAS_DATA_FIFO 0 \
  CONFIG.S14_HAS_REGSLICE 0 \
  CONFIG.S15_ARB_PRIORITY 0 \
  CONFIG.S15_HAS_DATA_FIFO 0 \
  CONFIG.S15_HAS_REGSLICE 0 \
  CONFIG.STRATEGY 0 \
  CONFIG.SYNCHRONIZATION_STAGES 3 \
  CONFIG.XBAR_DATA_WIDTH 32 \
] [get_bd_cells interconnect_axihpm0fpd]
create_bd_cell -type ip -vlnv xilinx.com:ip:axi_interconnect:2.1 interconnect_axilite
set_property -dict [list \
  CONFIG.ENABLE_ADVANCED_OPTIONS 0 \
  CONFIG.ENABLE_PROTOCOL_CHECKERS 0 \
  CONFIG.M00_HAS_DATA_FIFO 0 \
  CONFIG.M00_HAS_REGSLICE 0 \
  CONFIG.M00_ISSUANCE 0 \
  CONFIG.M00_SECURE 0 \
  CONFIG.M01_HAS_DATA_FIFO 0 \
  CONFIG.M01_HAS_REGSLICE 0 \
  CONFIG.M01_ISSUANCE 0 \
  CONFIG.M01_SECURE 0 \
  CONFIG.M02_HAS_DATA_FIFO 0 \
  CONFIG.M02_HAS_REGSLICE 0 \
  CONFIG.M02_ISSUANCE 0 \
  CONFIG.M02_SECURE 0 \
  CONFIG.M03_HAS_DATA_FIFO 0 \
  CONFIG.M03_HAS_REGSLICE 0 \
  CONFIG.M03_ISSUANCE 0 \
  CONFIG.M03_SECURE 0 \
  CONFIG.M04_HAS_DATA_FIFO 0 \
  CONFIG.M04_HAS_REGSLICE 0 \
  CONFIG.M04_ISSUANCE 0 \
  CONFIG.M04_SECURE 0 \
  CONFIG.M05_HAS_DATA_FIFO 0 \
  CONFIG.M05_HAS_REGSLICE 0 \
  CONFIG.M05_ISSUANCE 0 \
  CONFIG.M05_SECURE 0 \
  CONFIG.M06_HAS_DATA_FIFO 0 \
  CONFIG.M06_HAS_REGSLICE 0 \
  CONFIG.M06_ISSUANCE 0 \
  CONFIG.M06_SECURE 0 \
  CONFIG.M07_HAS_DATA_FIFO 0 \
  CONFIG.M07_HAS_REGSLICE 0 \
  CONFIG.M07_ISSUANCE 0 \
  CONFIG.M07_SECURE 0 \
  CONFIG.M08_HAS_DATA_FIFO 0 \
  CONFIG.M08_HAS_REGSLICE 0 \
  CONFIG.M08_ISSUANCE 0 \
  CONFIG.M08_SECURE 0 \
  CONFIG.M09_HAS_DATA_FIFO 0 \
  CONFIG.M09_HAS_REGSLICE 0 \
  CONFIG.M09_ISSUANCE 0 \
  CONFIG.M09_SECURE 0 \
  CONFIG.M10_HAS_DATA_FIFO 0 \
  CONFIG.M10_HAS_REGSLICE 0 \
  CONFIG.M10_ISSUANCE 0 \
  CONFIG.M10_SECURE 0 \
  CONFIG.M11_HAS_DATA_FIFO 0 \
  CONFIG.M11_HAS_REGSLICE 0 \
  CONFIG.M11_ISSUANCE 0 \
  CONFIG.M11_SECURE 0 \
  CONFIG.M12_HAS_DATA_FIFO 0 \
  CONFIG.M12_HAS_REGSLICE 0 \
  CONFIG.M12_ISSUANCE 0 \
  CONFIG.M12_SECURE 0 \
  CONFIG.M13_HAS_DATA_FIFO 0 \
  CONFIG.M13_HAS_REGSLICE 0 \
  CONFIG.M13_ISSUANCE 0 \
  CONFIG.M13_SECURE 0 \
  CONFIG.M14_HAS_DATA_FIFO 0 \
  CONFIG.M14_HAS_REGSLICE 0 \
  CONFIG.M14_ISSUANCE 0 \
  CONFIG.M14_SECURE 0 \
  CONFIG.M15_HAS_DATA_FIFO 0 \
  CONFIG.M15_HAS_REGSLICE 0 \
  CONFIG.M15_ISSUANCE 0 \
  CONFIG.M15_SECURE 0 \
  CONFIG.M16_HAS_DATA_FIFO 0 \
  CONFIG.M16_HAS_REGSLICE 0 \
  CONFIG.M16_ISSUANCE 0 \
  CONFIG.M16_SECURE 0 \
  CONFIG.M17_HAS_DATA_FIFO 0 \
  CONFIG.M17_HAS_REGSLICE 0 \
  CONFIG.M17_ISSUANCE 0 \
  CONFIG.M17_SECURE 0 \
  CONFIG.M18_HAS_DATA_FIFO 0 \
  CONFIG.M18_HAS_REGSLICE 0 \
  CONFIG.M18_ISSUANCE 0 \
  CONFIG.M18_SECURE 0 \
  CONFIG.M19_HAS_DATA_FIFO 0 \
  CONFIG.M19_HAS_REGSLICE 0 \
  CONFIG.M19_ISSUANCE 0 \
  CONFIG.M19_SECURE 0 \
  CONFIG.M20_HAS_DATA_FIFO 0 \
  CONFIG.M20_HAS_REGSLICE 0 \
  CONFIG.M20_ISSUANCE 0 \
  CONFIG.M20_SECURE 0 \
  CONFIG.M21_HAS_DATA_FIFO 0 \
  CONFIG.M21_HAS_REGSLICE 0 \
  CONFIG.M21_ISSUANCE 0 \
  CONFIG.M21_SECURE 0 \
  CONFIG.M22_HAS_DATA_FIFO 0 \
  CONFIG.M22_HAS_REGSLICE 0 \
  CONFIG.M22_ISSUANCE 0 \
  CONFIG.M22_SECURE 0 \
  CONFIG.M23_HAS_DATA_FIFO 0 \
  CONFIG.M23_HAS_REGSLICE 0 \
  CONFIG.M23_ISSUANCE 0 \
  CONFIG.M23_SECURE 0 \
  CONFIG.M24_HAS_DATA_FIFO 0 \
  CONFIG.M24_HAS_REGSLICE 0 \
  CONFIG.M24_ISSUANCE 0 \
  CONFIG.M24_SECURE 0 \
  CONFIG.M25_HAS_DATA_FIFO 0 \
  CONFIG.M25_HAS_REGSLICE 0 \
  CONFIG.M25_ISSUANCE 0 \
  CONFIG.M25_SECURE 0 \
  CONFIG.M26_HAS_DATA_FIFO 0 \
  CONFIG.M26_HAS_REGSLICE 0 \
  CONFIG.M26_ISSUANCE 0 \
  CONFIG.M26_SECURE 0 \
  CONFIG.M27_HAS_DATA_FIFO 0 \
  CONFIG.M27_HAS_REGSLICE 0 \
  CONFIG.M27_ISSUANCE 0 \
  CONFIG.M27_SECURE 0 \
  CONFIG.M28_HAS_DATA_FIFO 0 \
  CONFIG.M28_HAS_REGSLICE 0 \
  CONFIG.M28_ISSUANCE 0 \
  CONFIG.M28_SECURE 0 \
  CONFIG.M29_HAS_DATA_FIFO 0 \
  CONFIG.M29_HAS_REGSLICE 0 \
  CONFIG.M29_ISSUANCE 0 \
  CONFIG.M29_SECURE 0 \
  CONFIG.M30_HAS_DATA_FIFO 0 \
  CONFIG.M30_HAS_REGSLICE 0 \
  CONFIG.M30_ISSUANCE 0 \
  CONFIG.M30_SECURE 0 \
  CONFIG.M31_HAS_DATA_FIFO 0 \
  CONFIG.M31_HAS_REGSLICE 0 \
  CONFIG.M31_ISSUANCE 0 \
  CONFIG.M31_SECURE 0 \
  CONFIG.M32_HAS_DATA_FIFO 0 \
  CONFIG.M32_HAS_REGSLICE 0 \
  CONFIG.M32_ISSUANCE 0 \
  CONFIG.M32_SECURE 0 \
  CONFIG.M33_HAS_DATA_FIFO 0 \
  CONFIG.M33_HAS_REGSLICE 0 \
  CONFIG.M33_ISSUANCE 0 \
  CONFIG.M33_SECURE 0 \
  CONFIG.M34_HAS_DATA_FIFO 0 \
  CONFIG.M34_HAS_REGSLICE 0 \
  CONFIG.M34_ISSUANCE 0 \
  CONFIG.M34_SECURE 0 \
  CONFIG.M35_HAS_DATA_FIFO 0 \
  CONFIG.M35_HAS_REGSLICE 0 \
  CONFIG.M35_ISSUANCE 0 \
  CONFIG.M35_SECURE 0 \
  CONFIG.M36_HAS_DATA_FIFO 0 \
  CONFIG.M36_HAS_REGSLICE 0 \
  CONFIG.M36_ISSUANCE 0 \
  CONFIG.M36_SECURE 0 \
  CONFIG.M37_HAS_DATA_FIFO 0 \
  CONFIG.M37_HAS_REGSLICE 0 \
  CONFIG.M37_ISSUANCE 0 \
  CONFIG.M37_SECURE 0 \
  CONFIG.M38_HAS_DATA_FIFO 0 \
  CONFIG.M38_HAS_REGSLICE 0 \
  CONFIG.M38_ISSUANCE 0 \
  CONFIG.M38_SECURE 0 \
  CONFIG.M39_HAS_DATA_FIFO 0 \
  CONFIG.M39_HAS_REGSLICE 0 \
  CONFIG.M39_ISSUANCE 0 \
  CONFIG.M39_SECURE 0 \
  CONFIG.M40_HAS_DATA_FIFO 0 \
  CONFIG.M40_HAS_REGSLICE 0 \
  CONFIG.M40_ISSUANCE 0 \
  CONFIG.M40_SECURE 0 \
  CONFIG.M41_HAS_DATA_FIFO 0 \
  CONFIG.M41_HAS_REGSLICE 0 \
  CONFIG.M41_ISSUANCE 0 \
  CONFIG.M41_SECURE 0 \
  CONFIG.M42_HAS_DATA_FIFO 0 \
  CONFIG.M42_HAS_REGSLICE 0 \
  CONFIG.M42_ISSUANCE 0 \
  CONFIG.M42_SECURE 0 \
  CONFIG.M43_HAS_DATA_FIFO 0 \
  CONFIG.M43_HAS_REGSLICE 0 \
  CONFIG.M43_ISSUANCE 0 \
  CONFIG.M43_SECURE 0 \
  CONFIG.M44_HAS_DATA_FIFO 0 \
  CONFIG.M44_HAS_REGSLICE 0 \
  CONFIG.M44_ISSUANCE 0 \
  CONFIG.M44_SECURE 0 \
  CONFIG.M45_HAS_DATA_FIFO 0 \
  CONFIG.M45_HAS_REGSLICE 0 \
  CONFIG.M45_ISSUANCE 0 \
  CONFIG.M45_SECURE 0 \
  CONFIG.M46_HAS_DATA_FIFO 0 \
  CONFIG.M46_HAS_REGSLICE 0 \
  CONFIG.M46_ISSUANCE 0 \
  CONFIG.M46_SECURE 0 \
  CONFIG.M47_HAS_DATA_FIFO 0 \
  CONFIG.M47_HAS_REGSLICE 0 \
  CONFIG.M47_ISSUANCE 0 \
  CONFIG.M47_SECURE 0 \
  CONFIG.M48_HAS_DATA_FIFO 0 \
  CONFIG.M48_HAS_REGSLICE 0 \
  CONFIG.M48_ISSUANCE 0 \
  CONFIG.M48_SECURE 0 \
  CONFIG.M49_HAS_DATA_FIFO 0 \
  CONFIG.M49_HAS_REGSLICE 0 \
  CONFIG.M49_ISSUANCE 0 \
  CONFIG.M49_SECURE 0 \
  CONFIG.M50_HAS_DATA_FIFO 0 \
  CONFIG.M50_HAS_REGSLICE 0 \
  CONFIG.M50_ISSUANCE 0 \
  CONFIG.M50_SECURE 0 \
  CONFIG.M51_HAS_DATA_FIFO 0 \
  CONFIG.M51_HAS_REGSLICE 0 \
  CONFIG.M51_ISSUANCE 0 \
  CONFIG.M51_SECURE 0 \
  CONFIG.M52_HAS_DATA_FIFO 0 \
  CONFIG.M52_HAS_REGSLICE 0 \
  CONFIG.M52_ISSUANCE 0 \
  CONFIG.M52_SECURE 0 \
  CONFIG.M53_HAS_DATA_FIFO 0 \
  CONFIG.M53_HAS_REGSLICE 0 \
  CONFIG.M53_ISSUANCE 0 \
  CONFIG.M53_SECURE 0 \
  CONFIG.M54_HAS_DATA_FIFO 0 \
  CONFIG.M54_HAS_REGSLICE 0 \
  CONFIG.M54_ISSUANCE 0 \
  CONFIG.M54_SECURE 0 \
  CONFIG.M55_HAS_DATA_FIFO 0 \
  CONFIG.M55_HAS_REGSLICE 0 \
  CONFIG.M55_ISSUANCE 0 \
  CONFIG.M55_SECURE 0 \
  CONFIG.M56_HAS_DATA_FIFO 0 \
  CONFIG.M56_HAS_REGSLICE 0 \
  CONFIG.M56_ISSUANCE 0 \
  CONFIG.M56_SECURE 0 \
  CONFIG.M57_HAS_DATA_FIFO 0 \
  CONFIG.M57_HAS_REGSLICE 0 \
  CONFIG.M57_ISSUANCE 0 \
  CONFIG.M57_SECURE 0 \
  CONFIG.M58_HAS_DATA_FIFO 0 \
  CONFIG.M58_HAS_REGSLICE 0 \
  CONFIG.M58_ISSUANCE 0 \
  CONFIG.M58_SECURE 0 \
  CONFIG.M59_HAS_DATA_FIFO 0 \
  CONFIG.M59_HAS_REGSLICE 0 \
  CONFIG.M59_ISSUANCE 0 \
  CONFIG.M59_SECURE 0 \
  CONFIG.M60_HAS_DATA_FIFO 0 \
  CONFIG.M60_HAS_REGSLICE 0 \
  CONFIG.M60_ISSUANCE 0 \
  CONFIG.M60_SECURE 0 \
  CONFIG.M61_HAS_DATA_FIFO 0 \
  CONFIG.M61_HAS_REGSLICE 0 \
  CONFIG.M61_ISSUANCE 0 \
  CONFIG.M61_SECURE 0 \
  CONFIG.M62_HAS_DATA_FIFO 0 \
  CONFIG.M62_HAS_REGSLICE 0 \
  CONFIG.M62_ISSUANCE 0 \
  CONFIG.M62_SECURE 0 \
  CONFIG.M63_HAS_DATA_FIFO 0 \
  CONFIG.M63_HAS_REGSLICE 0 \
  CONFIG.M63_ISSUANCE 0 \
  CONFIG.M63_SECURE 0 \
  CONFIG.NUM_MI 3 \
  CONFIG.NUM_SI 1 \
  CONFIG.PCHK_MAX_RD_BURSTS 2 \
  CONFIG.PCHK_MAX_WR_BURSTS 2 \
  CONFIG.PCHK_WAITS 0 \
  CONFIG.S00_ARB_PRIORITY 0 \
  CONFIG.S00_HAS_DATA_FIFO 0 \
  CONFIG.S00_HAS_REGSLICE 0 \
  CONFIG.S01_ARB_PRIORITY 0 \
  CONFIG.S01_HAS_DATA_FIFO 0 \
  CONFIG.S01_HAS_REGSLICE 0 \
  CONFIG.S02_ARB_PRIORITY 0 \
  CONFIG.S02_HAS_DATA_FIFO 0 \
  CONFIG.S02_HAS_REGSLICE 0 \
  CONFIG.S03_ARB_PRIORITY 0 \
  CONFIG.S03_HAS_DATA_FIFO 0 \
  CONFIG.S03_HAS_REGSLICE 0 \
  CONFIG.S04_ARB_PRIORITY 0 \
  CONFIG.S04_HAS_DATA_FIFO 0 \
  CONFIG.S04_HAS_REGSLICE 0 \
  CONFIG.S05_ARB_PRIORITY 0 \
  CONFIG.S05_HAS_DATA_FIFO 0 \
  CONFIG.S05_HAS_REGSLICE 0 \
  CONFIG.S06_ARB_PRIORITY 0 \
  CONFIG.S06_HAS_DATA_FIFO 0 \
  CONFIG.S06_HAS_REGSLICE 0 \
  CONFIG.S07_ARB_PRIORITY 0 \
  CONFIG.S07_HAS_DATA_FIFO 0 \
  CONFIG.S07_HAS_REGSLICE 0 \
  CONFIG.S08_ARB_PRIORITY 0 \
  CONFIG.S08_HAS_DATA_FIFO 0 \
  CONFIG.S08_HAS_REGSLICE 0 \
  CONFIG.S09_ARB_PRIORITY 0 \
  CONFIG.S09_HAS_DATA_FIFO 0 \
  CONFIG.S09_HAS_REGSLICE 0 \
  CONFIG.S10_ARB_PRIORITY 0 \
  CONFIG.S10_HAS_DATA_FIFO 0 \
  CONFIG.S10_HAS_REGSLICE 0 \
  CONFIG.S11_ARB_PRIORITY 0 \
  CONFIG.S11_HAS_DATA_FIFO 0 \
  CONFIG.S11_HAS_REGSLICE 0 \
  CONFIG.S12_ARB_PRIORITY 0 \
  CONFIG.S12_HAS_DATA_FIFO 0 \
  CONFIG.S12_HAS_REGSLICE 0 \
  CONFIG.S13_ARB_PRIORITY 0 \
  CONFIG.S13_HAS_DATA_FIFO 0 \
  CONFIG.S13_HAS_REGSLICE 0 \
  CONFIG.S14_ARB_PRIORITY 0 \
  CONFIG.S14_HAS_DATA_FIFO 0 \
  CONFIG.S14_HAS_REGSLICE 0 \
  CONFIG.S15_ARB_PRIORITY 0 \
  CONFIG.S15_HAS_DATA_FIFO 0 \
  CONFIG.S15_HAS_REGSLICE 0 \
  CONFIG.STRATEGY 0 \
  CONFIG.SYNCHRONIZATION_STAGES 3 \
  CONFIG.XBAR_DATA_WIDTH 32 \
] [get_bd_cells interconnect_axilite]
create_bd_cell -type ip -vlnv xilinx.com:ip:proc_sys_reset:5.0 proc_sys_reset_0
set_property -dict [list \
  CONFIG.C_AUX_RESET_HIGH 0 \
  CONFIG.C_AUX_RST_WIDTH 4 \
  CONFIG.C_EXT_RST_WIDTH 4 \
  CONFIG.C_NUM_BUS_RST 1 \
  CONFIG.C_NUM_INTERCONNECT_ARESETN 1 \
  CONFIG.C_NUM_PERP_ARESETN 1 \
  CONFIG.C_NUM_PERP_RST 1 \
  CONFIG.RESET_BOARD_INTERFACE Custom \
  CONFIG.USE_BOARD_FLOW false \
] [get_bd_cells proc_sys_reset_0]
create_bd_cell -type ip -vlnv xilinx.com:ip:proc_sys_reset:5.0 proc_sys_reset_1
set_property -dict [list \
  CONFIG.C_AUX_RESET_HIGH 0 \
  CONFIG.C_AUX_RST_WIDTH 4 \
  CONFIG.C_EXT_RST_WIDTH 4 \
  CONFIG.C_NUM_BUS_RST 1 \
  CONFIG.C_NUM_INTERCONNECT_ARESETN 1 \
  CONFIG.C_NUM_PERP_ARESETN 1 \
  CONFIG.C_NUM_PERP_RST 1 \
  CONFIG.RESET_BOARD_INTERFACE Custom \
  CONFIG.USE_BOARD_FLOW false \
] [get_bd_cells proc_sys_reset_1]
create_bd_cell -type ip -vlnv xilinx.com:ip:proc_sys_reset:5.0 proc_sys_reset_2
set_property -dict [list \
  CONFIG.C_AUX_RESET_HIGH 0 \
  CONFIG.C_AUX_RST_WIDTH 4 \
  CONFIG.C_EXT_RST_WIDTH 4 \
  CONFIG.C_NUM_BUS_RST 1 \
  CONFIG.C_NUM_INTERCONNECT_ARESETN 1 \
  CONFIG.C_NUM_PERP_ARESETN 1 \
  CONFIG.C_NUM_PERP_RST 1 \
  CONFIG.RESET_BOARD_INTERFACE Custom \
  CONFIG.USE_BOARD_FLOW false \
] [get_bd_cells proc_sys_reset_2]
create_bd_cell -type ip -vlnv xilinx.com:ip:proc_sys_reset:5.0 proc_sys_reset_3
set_property -dict [list \
  CONFIG.C_AUX_RESET_HIGH 0 \
  CONFIG.C_AUX_RST_WIDTH 4 \
  CONFIG.C_EXT_RST_WIDTH 4 \
  CONFIG.C_NUM_BUS_RST 1 \
  CONFIG.C_NUM_INTERCONNECT_ARESETN 1 \
  CONFIG.C_NUM_PERP_ARESETN 1 \
  CONFIG.C_NUM_PERP_RST 1 \
  CONFIG.RESET_BOARD_INTERFACE Custom \
  CONFIG.USE_BOARD_FLOW false \
] [get_bd_cells proc_sys_reset_3]
create_bd_cell -type ip -vlnv xilinx.com:ip:proc_sys_reset:5.0 proc_sys_reset_4
set_property -dict [list \
  CONFIG.C_AUX_RESET_HIGH 0 \
  CONFIG.C_AUX_RST_WIDTH 4 \
  CONFIG.C_EXT_RST_WIDTH 4 \
  CONFIG.C_NUM_BUS_RST 1 \
  CONFIG.C_NUM_INTERCONNECT_ARESETN 1 \
  CONFIG.C_NUM_PERP_ARESETN 1 \
  CONFIG.C_NUM_PERP_RST 1 \
  CONFIG.RESET_BOARD_INTERFACE Custom \
  CONFIG.USE_BOARD_FLOW false \
] [get_bd_cells proc_sys_reset_4]
